# EAGLE design tube_board (EAGLE 8.1.0)

## Sheet 1 of 4
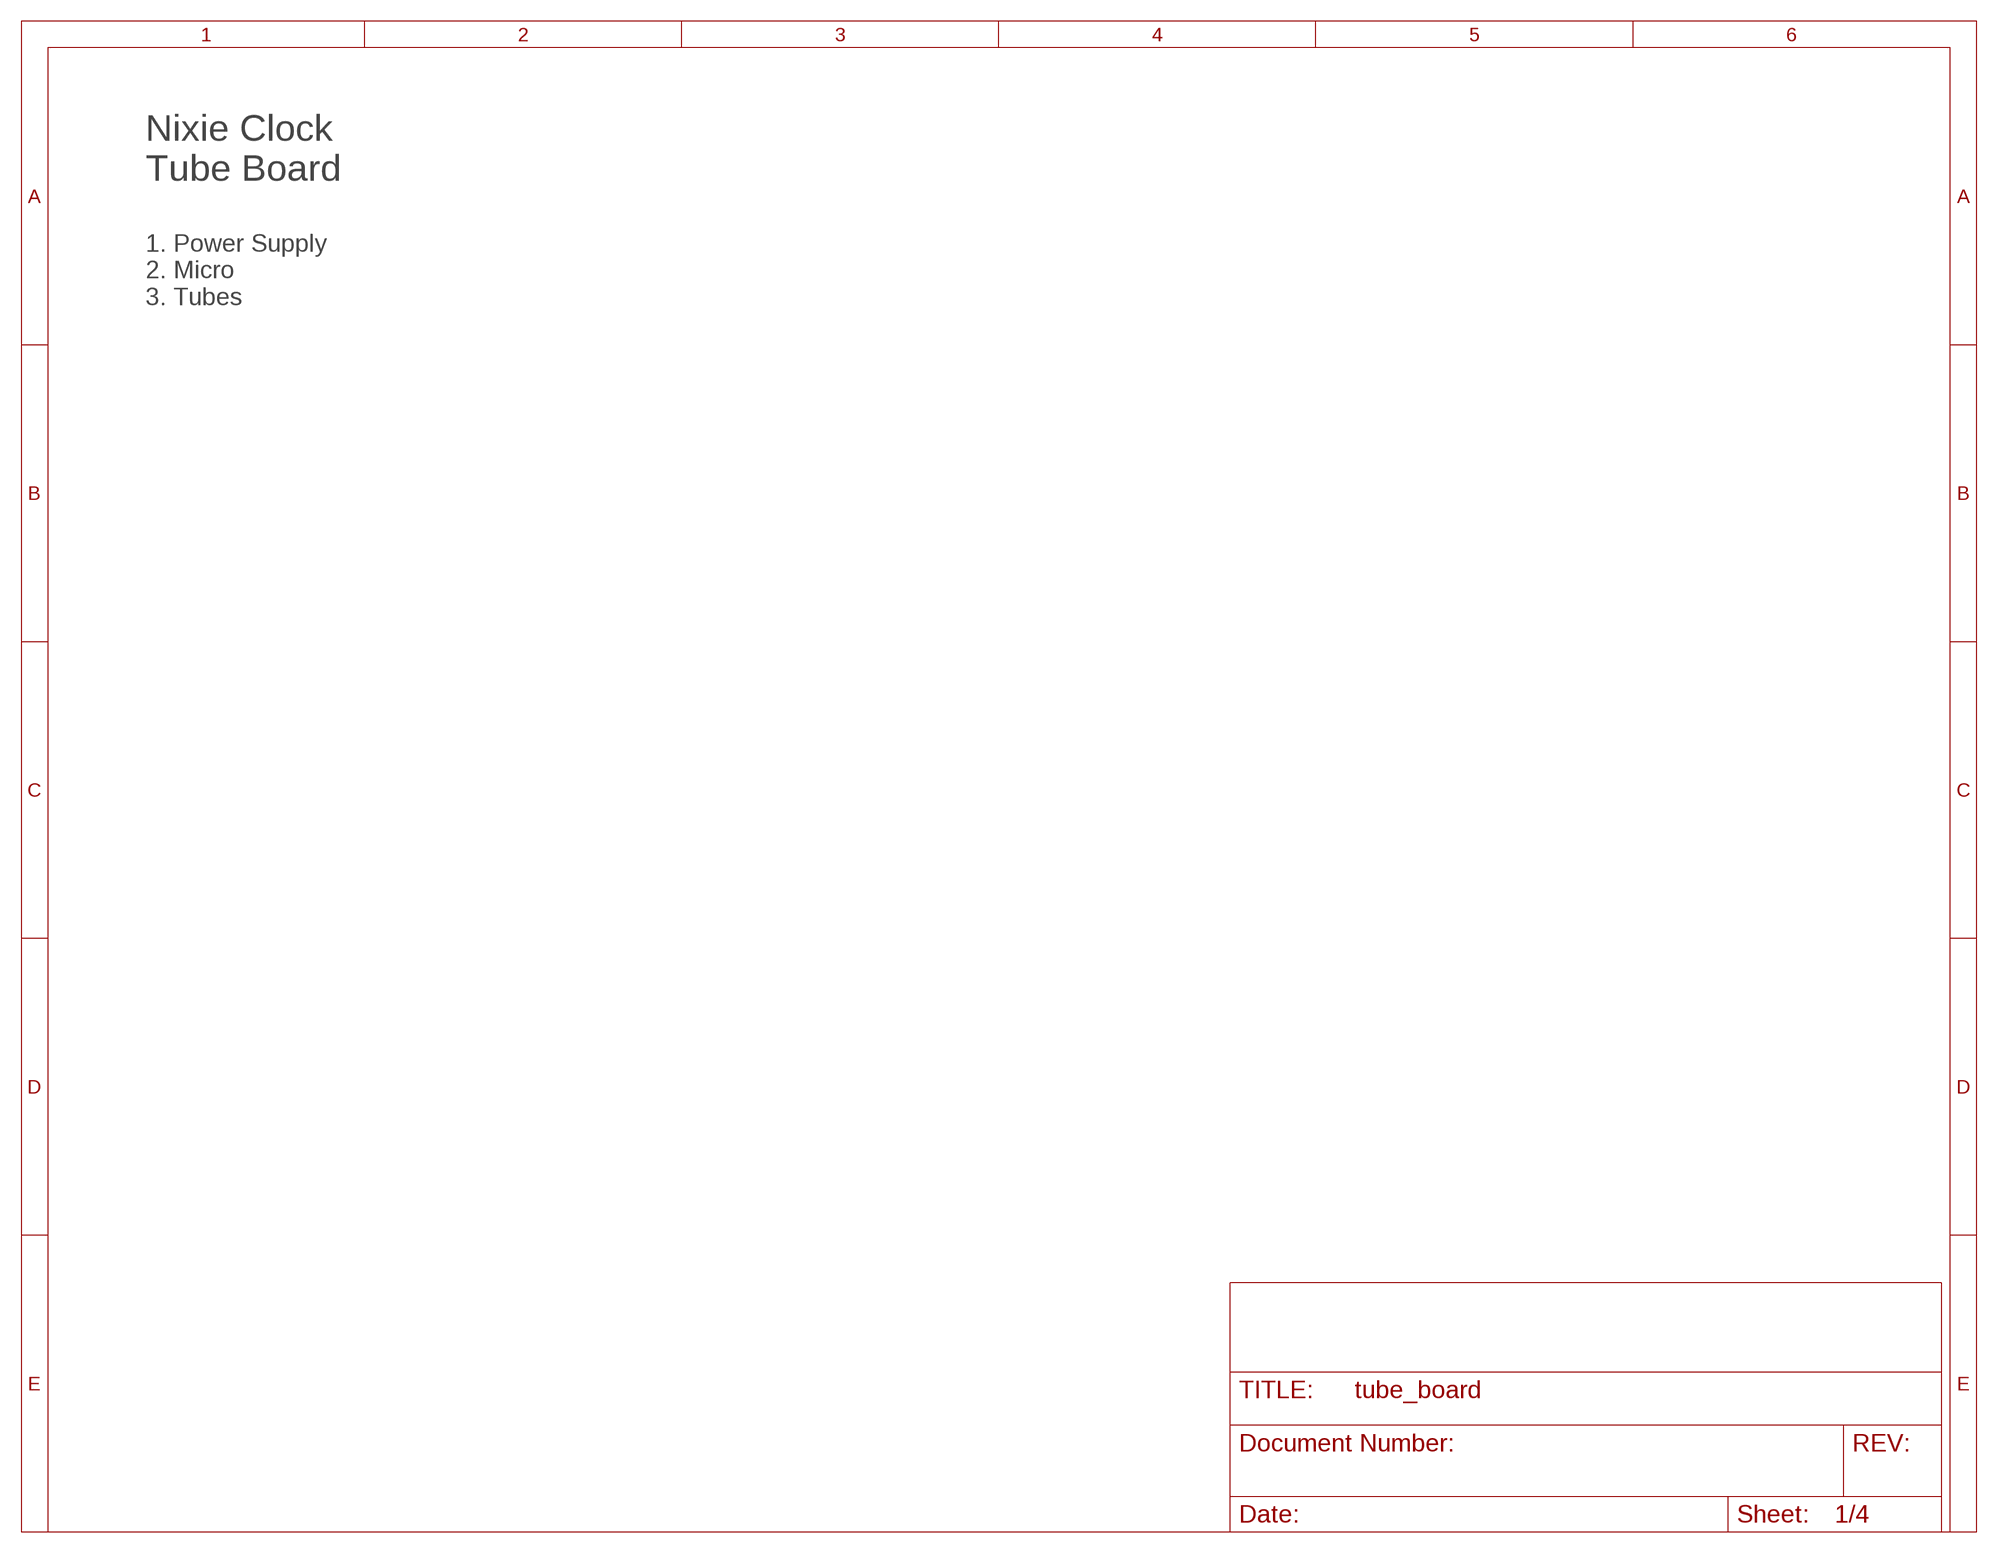
[diagram p0: schematic, sheet 1]

### Notes on the sheet
- Nixie Clock
  Tube Board
- 1. Power Supply
  2. Micro
  3. Tubes

## Sheet 2 of 4
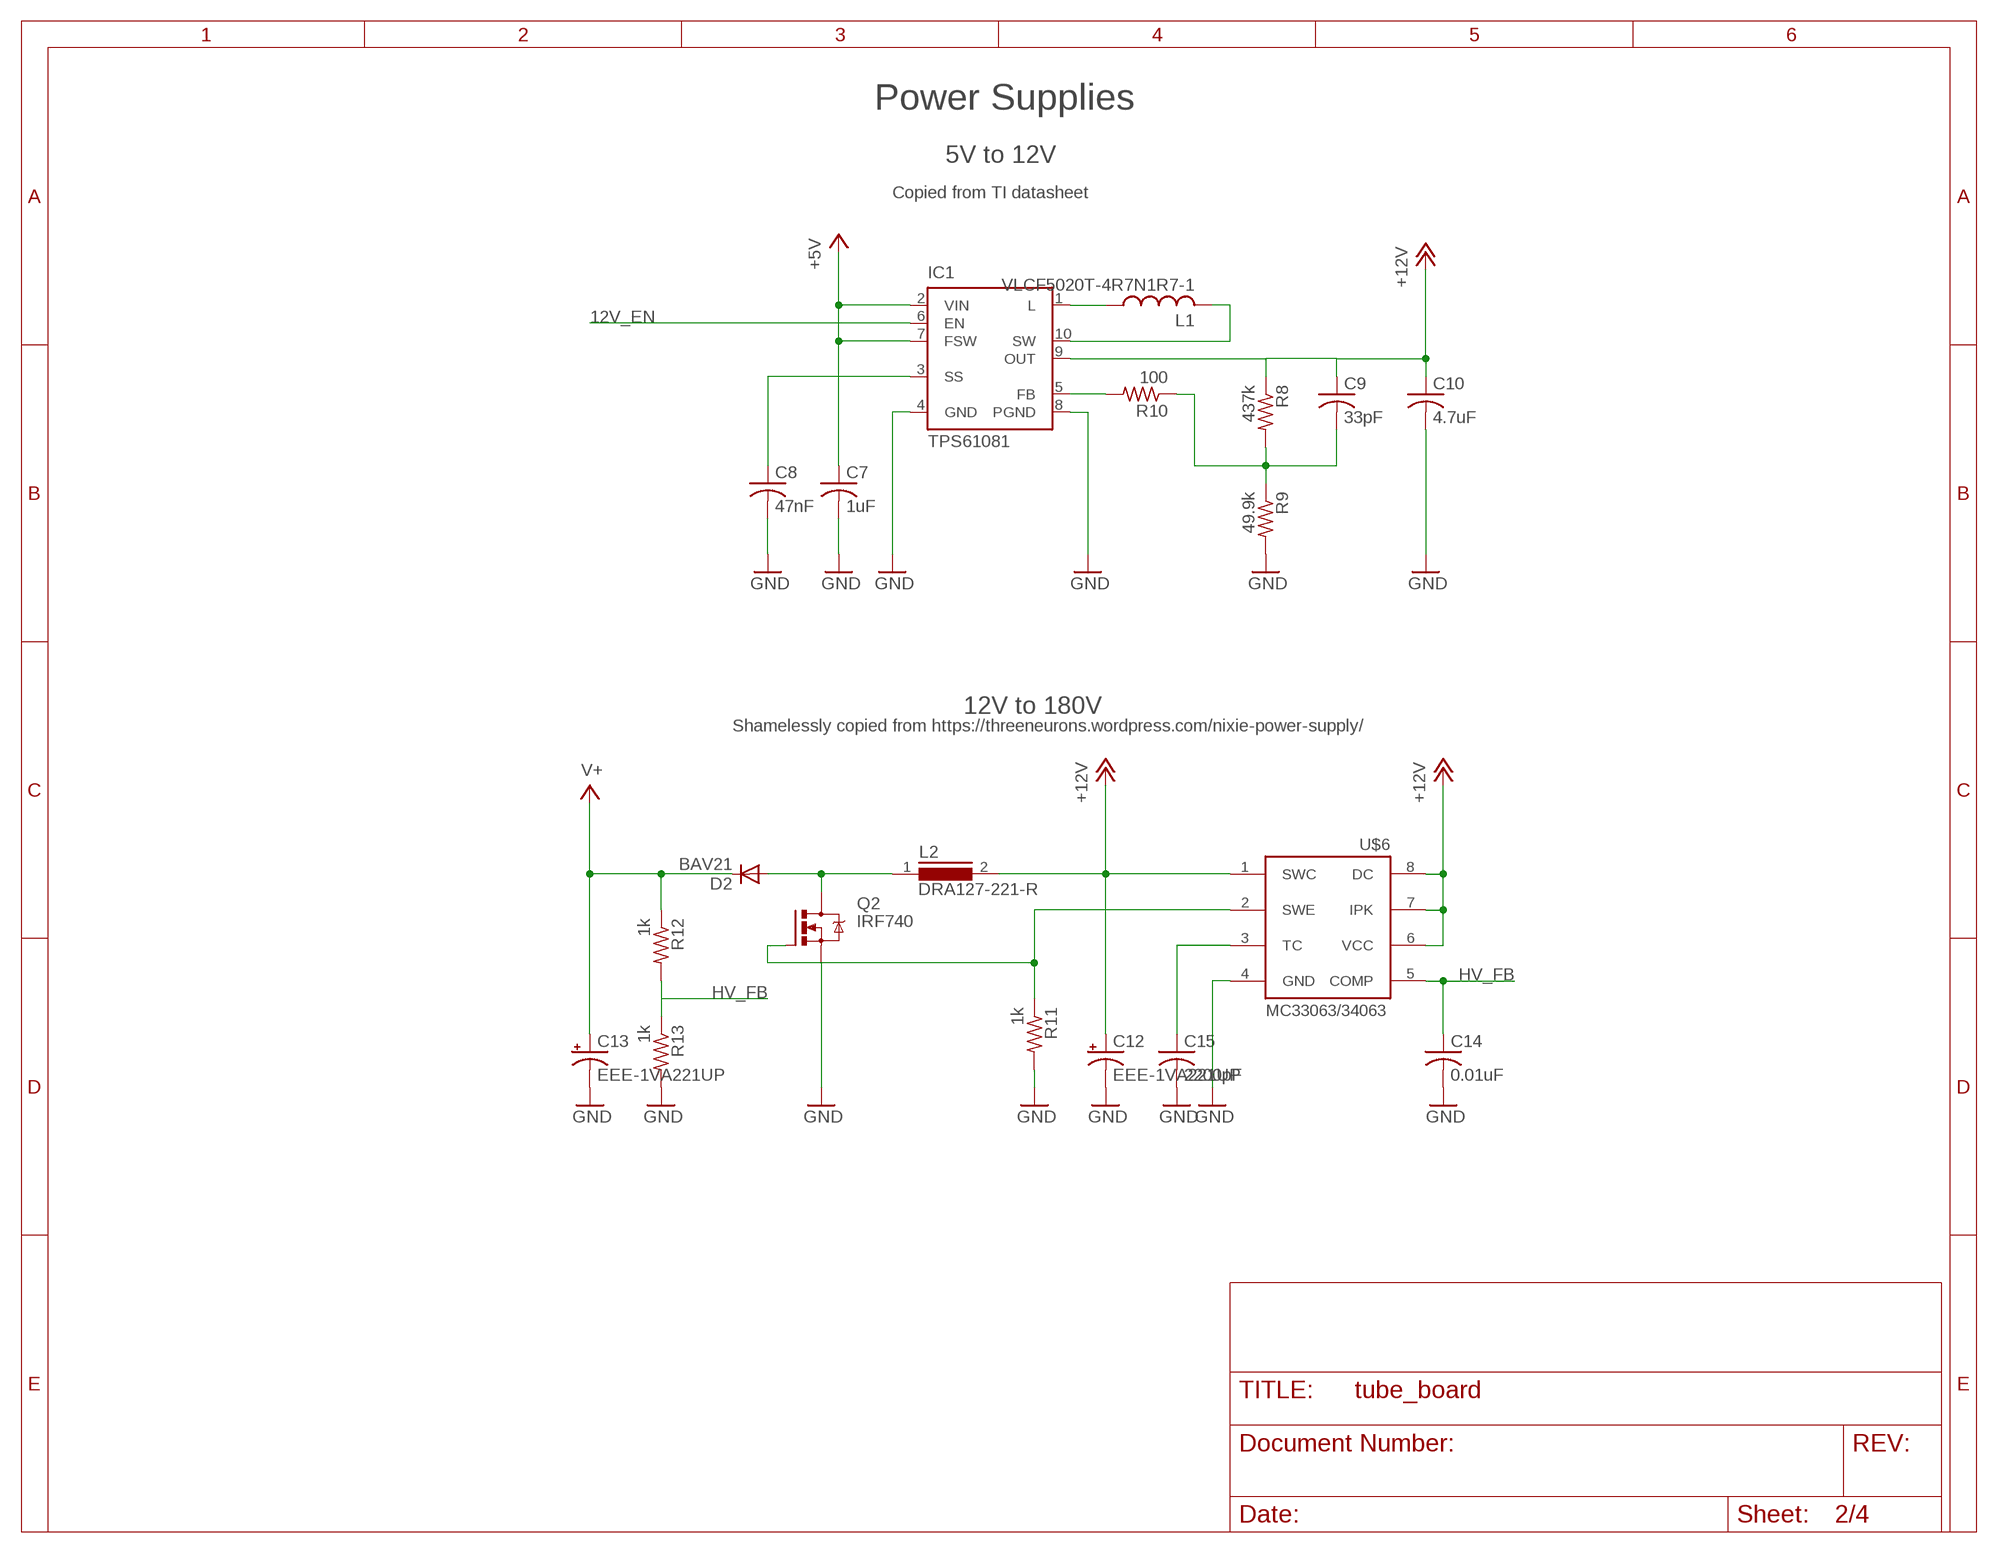
[diagram p1: schematic, sheet 2]

### Parts
C7  1uF  C-USC0603  [C0603]
C8  47nF  C-USC0603  [C0603]
C9  33pF  C-USC0603  [C0603]
C10  4.7uF  C-USC0603  [C0603]
C12  EEE-1VA221UP  CPOL-USG  [PANASONIC_G]
C13  EEE-1VA221UP  CPOL-USG  [PANASONIC_G]
C14  0.01uF  C-USC0603  [C0603]
C15  2200pF  C-USC0603  [C0603]
D2  BAV21  DIODE-SOD323-R  [SOD323-R]
IC1  TPS61081  [S-PDSO-N10]
L1  VLCF5020T-4R7N1R7-1  L-USL5650M  [L5650M]
L2  DRA127-221-R  DR127  [DR127]
Q2  IRF740  [TO220BV]
R8  437k  R-US_R0603  [R0603]
R9  49.9k  R-US_R0603  [R0603]
R10  100  R-US_R0603  [R0603]
R11  1k  R-US_R0603  [R0603]
R12  1k  R-US_R0603  [R0603]
R13  1k  R-US_R0603  [R0603]
U$6  MC34063D  MC33063/MC34063D  [SO08]

### Nets
12V_EN: IC1.6(EN) ; also sheet 3
+5V: C7.1 IC1.2(VIN) IC1.7(FSW) ; also sheet 3,4
+12V: C9.1 C10.1 C12.+ IC1.9(OUT) L2.2 R8.1 U$6.1(SWC) U$6.6(VCC) U$6.7(IPK) U$6.8(DC) ; also sheet 4
GND: C7.2 C8.2 C10.2 C12.- C13.- C14.2 C15.2 IC1.4(GND) IC1.8(PGND) Q2.S R9.2 R11.2 R13.2 U$6.4(GND) ; also sheet 3,4
HV_FB: C14.1 R12.2 R13.1 U$6.5(COMP)
N$8: IC1.1(L) L1.1
N$9: IC1.10(SW) L1.2
N$10: C8.1 IC1.3(SS)
N$12: C9.2 R8.2 R9.1 R10.1
N$13: D2.A L2.1 Q2.D
N$14: C15.1 U$6.3(TC)
N$15: IC1.5(FB) R10.2
N$16: Q2.G R11.1 U$6.2(SWE)
V+: C13.+ D2.C R12.1 ; also sheet 4
Unconnected: IC1.PP(EXP) IC1.PP@1(EXP) IC1.PP@2(EXP)

### Notes on the sheet
- Power Supplies
- 5V to 12V
- Copied from TI datasheet
- 12V to 180V
- Shamelessly copied from https://threeneurons.wordpress.com/nixie-power-supply/

## Sheet 3 of 4
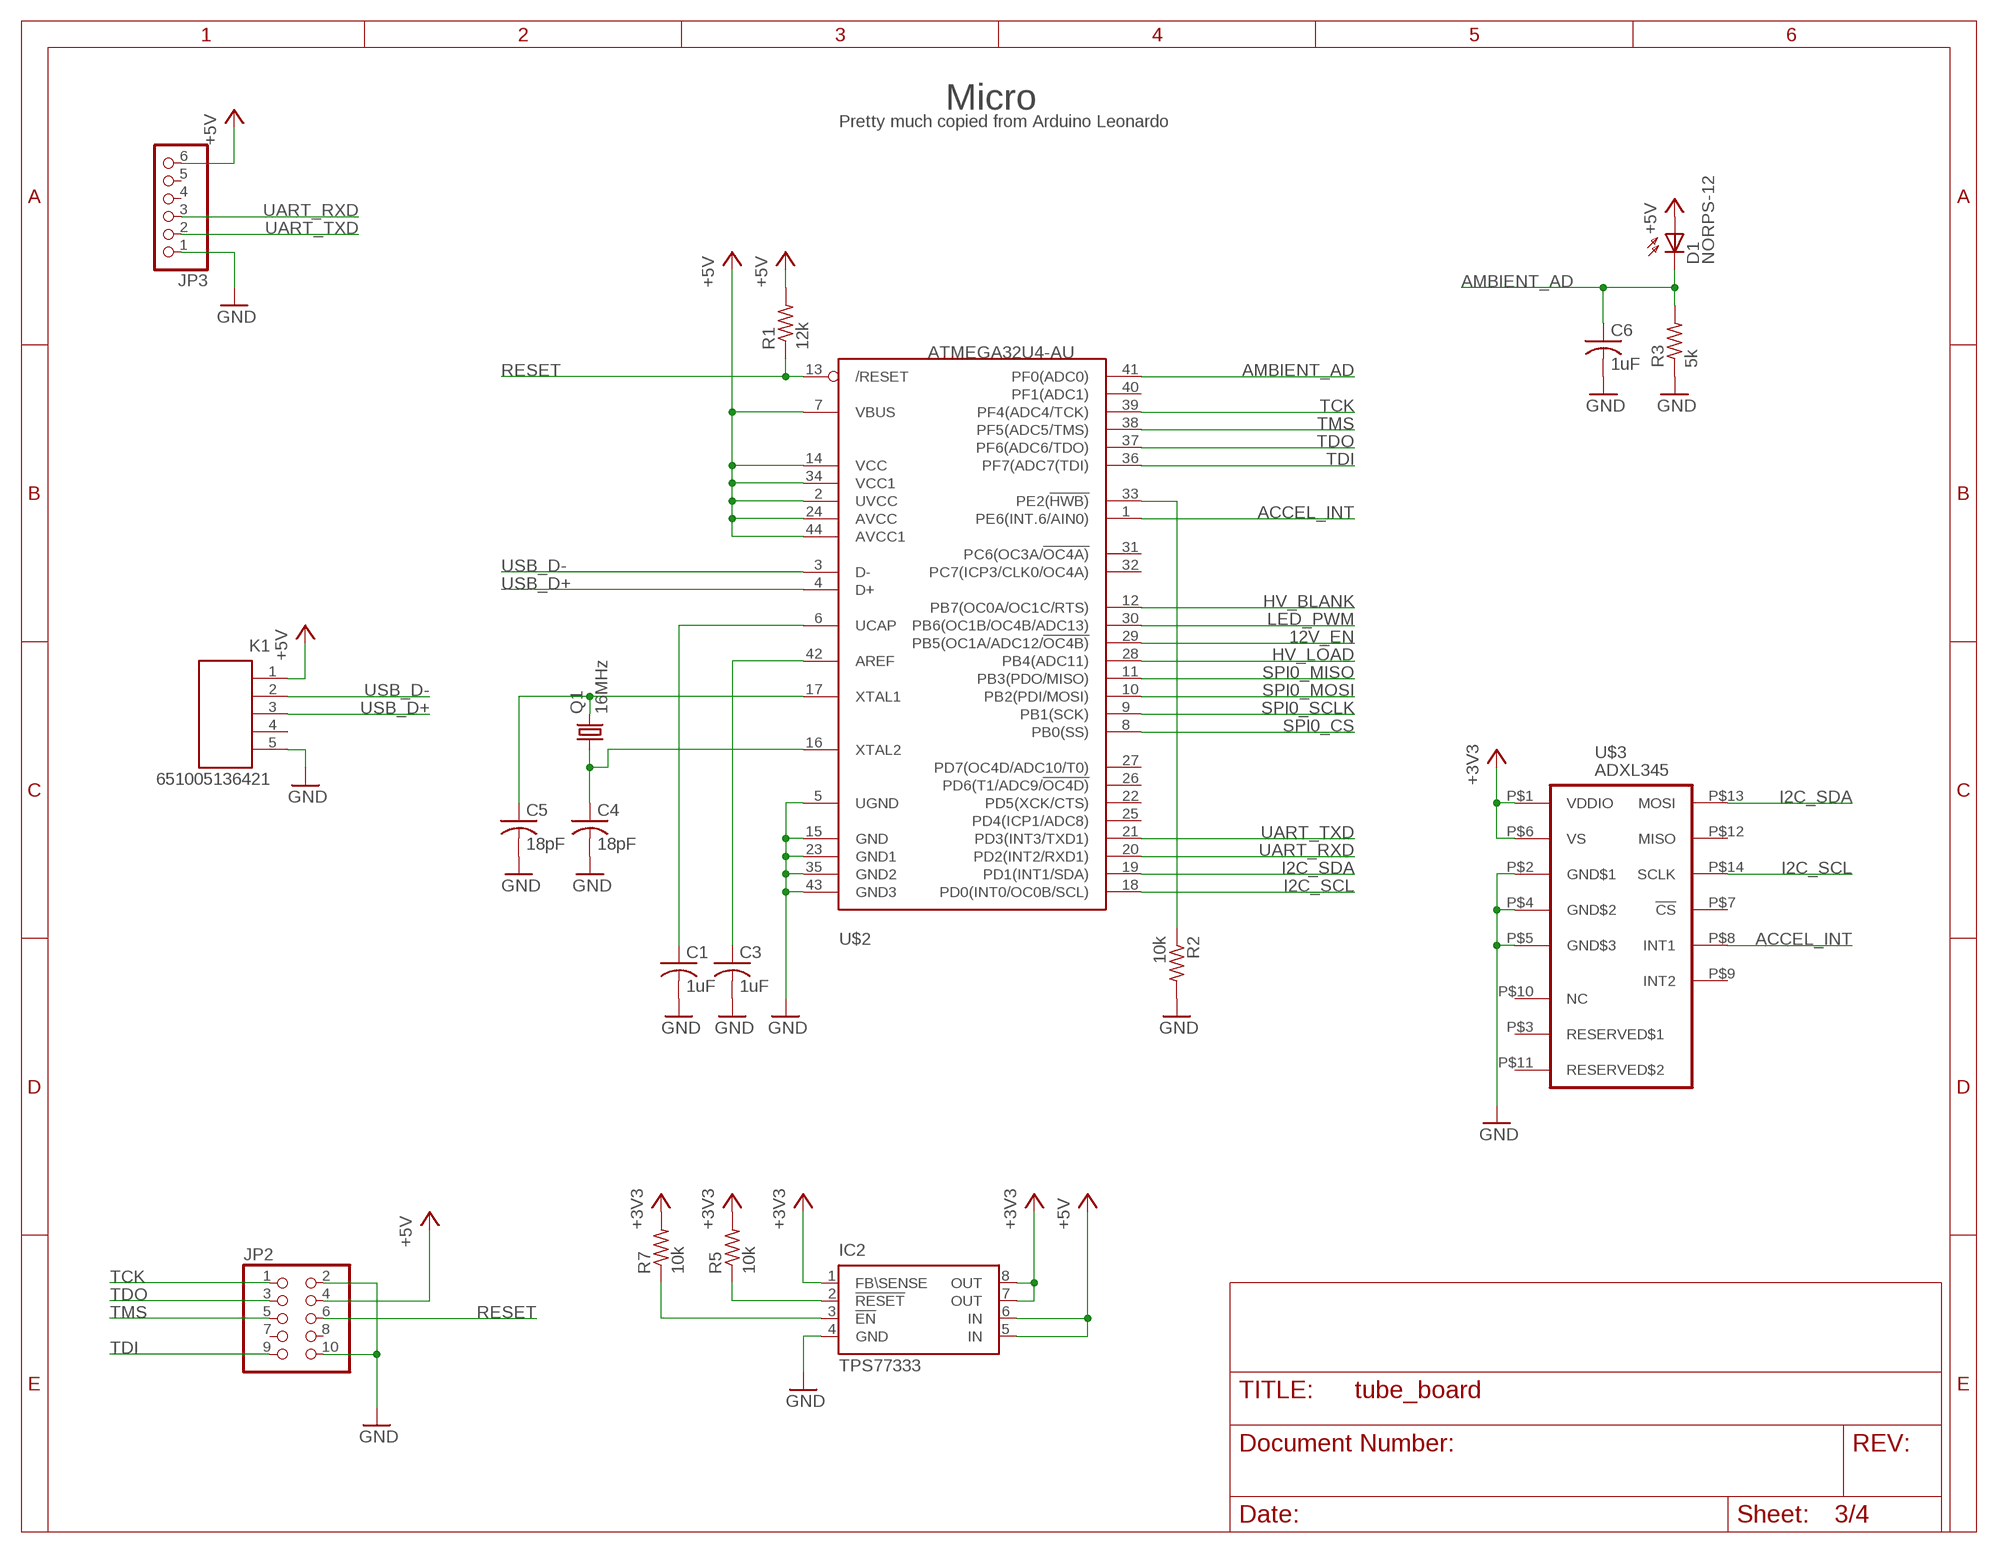
[diagram p2: schematic, sheet 3]

### Parts
C1  1uF  C-USC0603  [C0603]
C3  1uF  C-USC0603  [C0603]
C4  18pF  C-USC0603  [C0603]
C5  18pF  C-USC0603  [C0603]
C6  1uF  C-USC0603  [C0603]
D1  NORPS-12  BPX65  [BPX65]
IC2  TPS77333  [SOP-08]
JP2  PINHD-2X5  [2X05]
JP3  PINHD-1X6  [1X06]
K1  651005136421  [651005136421]
Q1  16MHz  CRYSTALCTS406  [CTS406]
R1  12k  R-US_R0603  [R0603]
R2  10k  R-US_R0603  [R0603]
R3  5k  R-US_R0603  [R0603]
R5  10k  R-US_R0603  [R0603]
R7  10k  R-US_R0603  [R0603]
U$2  ATMEGA32U4-AU  [TQFP44]
U$3  ADXL345  [LGA14]

### Nets
12V_EN: U$2.29(PB5(OC1A/ADC12/!OC4B)) ; also sheet 2
+3V3: IC2.1(FB\SENSE) IC2.7(OUT) IC2.8(OUT) R5.2 R7.2 U$3.P$1(VDDIO) U$3.P$6(VS)
+5V: D1.A IC2.5(IN) IC2.6(IN) JP2.4 JP3.6 K1.1 R1.2 U$2.2(UVCC) U$2.7(VBUS) U$2.14(VCC) U$2.24(AVCC) U$2.34(VCC1) U$2.44(AVCC1) ; also sheet 2,4
ACCEL_INT: U$2.1(PE6(INT.6/AIN0)) U$3.P$8(INT1)
AMBIENT_AD: C6.1 D1.K(C) R3.2 U$2.41(PF0(ADC0))
GND: C1.2 C3.2 C4.2 C5.2 C6.2 IC2.4(GND) JP2.2 JP2.10 JP3.1 K1.5 R2.2 R3.1 U$2.5(UGND) U$2.15(GND) U$2.23(GND1) U$2.35(GND2) U$2.43(GND3) U$3.P$2(GND$1) U$3.P$4(GND$2) U$3.P$5(GND$3) ; also sheet 2,4
HV_BLANK: U$2.12(PB7(OC0A/OC1C/RTS)) ; also sheet 4
HV_LOAD: U$2.28(PB4(ADC11)) ; also sheet 4
I2C_SCL: U$2.18(PD0(INT0/OC0B/SCL)) U$3.P$14(SCLK)
I2C_SDA: U$2.19(PD1(INT1/SDA)) U$3.P$13(MOSI)
LED_PWM: U$2.30(PB6(OC1B/OC4B/ADC13)) ; also sheet 4
N$1: IC2.2(!RESET) R5.1
N$2: C1.1 U$2.6(UCAP)
N$3: C3.1 U$2.42(AREF)
N$4: C5.1 Q1.3 U$2.17(XTAL1)
N$5: C4.1 Q1.1 U$2.16(XTAL2)
N$6: R2.1 U$2.33(PE2(!HWB))
N$7: IC2.3(!EN) R7.1
RESET: JP2.6 R1.1 U$2.13(/RESET)
SPI0_CS: U$2.8(PB0(SS))
SPI0_MISO: U$2.11(PB3(PDO/MISO))
SPI0_MOSI: U$2.10(PB2(PDI/MOSI)) ; also sheet 4
SPI0_SCLK: U$2.9(PB1(SCK)) ; also sheet 4
TCK: JP2.1 U$2.39(PF4(ADC4/TCK))
TDI: JP2.9 U$2.36(PF7(ADC7(TDI))
TDO: JP2.3 U$2.37(PF6(ADC6/TDO))
TMS: JP2.5 U$2.38(PF5(ADC5/TMS))
UART_RXD: JP3.3 U$2.20(PD2(INT2/RXD1))
UART_TXD: JP3.2 U$2.21(PD3(INT3/TXD1))
USB_D+: K1.3 U$2.4(D+)
USB_D-: K1.2 U$2.3(D-)
Unconnected: JP2.7 JP2.8 JP3.4 JP3.5 K1.4 U$2.22(PD5(XCK/CTS)) U$2.25(PD4(ICP1/ADC8)) U$2.26(PD6(T1/ADC9/!OC4D)) U$2.27(PD7(OC4D/ADC10/T0)) U$2.31(PC6(OC3A/!OC4A)) U$2.32(PC7(ICP3/CLK0/OC4A)) U$2.40(PF1(ADC1)) U$3.P$3(RESERVED$1) U$3.P$7(!CS) U$3.P$9(INT2) U$3.P$10(NC) U$3.P$11(RESERVED$2) U$3.P$12(MISO)

### Notes on the sheet
- Micro
- Pretty much copied from Arduino Leonardo

## Sheet 4 of 4
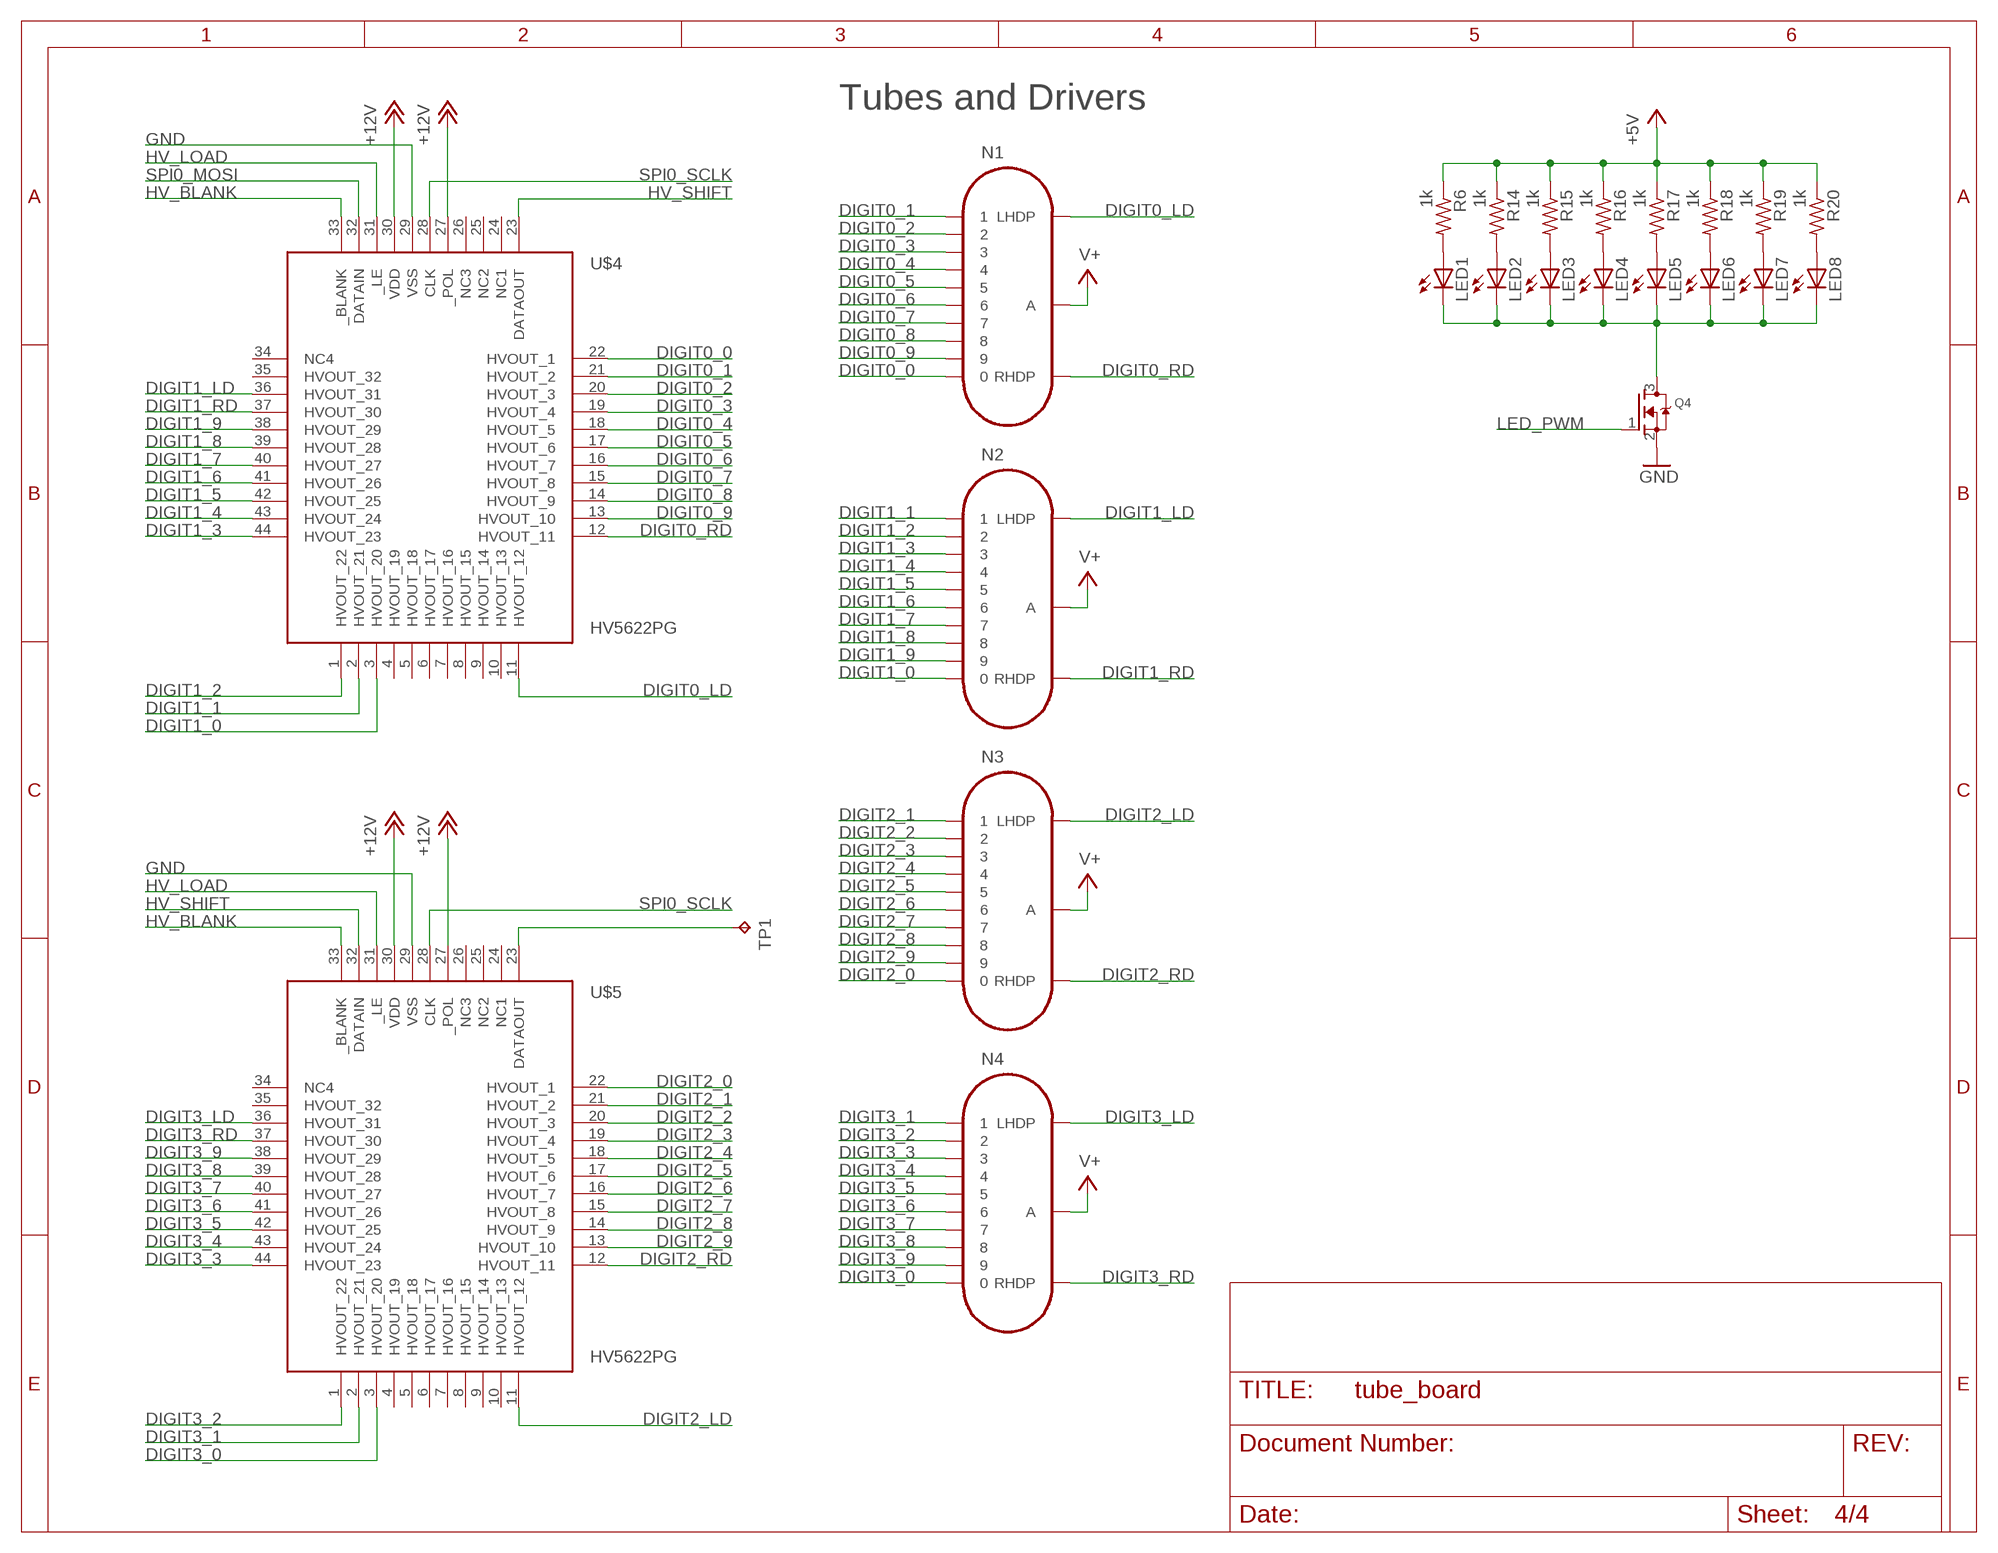
[diagram p3: schematic, sheet 4]

### Parts
LED1  LEDCHIPLED_0603  [CHIPLED_0603]
LED2  LEDCHIPLED_0603  [CHIPLED_0603]
LED3  LEDCHIPLED_0603  [CHIPLED_0603]
LED4  LEDCHIPLED_0603  [CHIPLED_0603]
LED5  LEDCHIPLED_0603  [CHIPLED_0603]
LED6  LEDCHIPLED_0603  [CHIPLED_0603]
LED7  LEDCHIPLED_0603  [CHIPLED_0603]
LED8  LEDCHIPLED_0603  [CHIPLED_0603]
N1  IN-14SMD  [IN-14-SMD]
N2  IN-14SMD  [IN-14-SMD]
N3  IN-14SMD  [IN-14-SMD]
N4  IN-14SMD  [IN-14-SMD]
Q4  MOSFET-NREFLOW  [SOT23]
R6  1k  R-US_R0603  [R0603]
R14  1k  R-US_R0603  [R0603]
R15  1k  R-US_R0603  [R0603]
R16  1k  R-US_R0603  [R0603]
R17  1k  R-US_R0603  [R0603]
R18  1k  R-US_R0603  [R0603]
R19  1k  R-US_R0603  [R0603]
R20  1k  R-US_R0603  [R0603]
TP1  TPTP07R  [TP07R]
U$4  HV5622PG  [PQFP-44]
U$5  HV5622PG  [PQFP-44]

### Nets
+5V: R6.1 R14.1 R15.1 R16.1 R17.1 R18.1 R19.1 R20.1 ; also sheet 2,3
+12V: U$4.30(VDD) U$5.27(_POL) U$5.30(VDD) ; also sheet 2
DIGIT0_0: N1.0 U$4.22(HVOUT_1)
DIGIT0_1: N1.1 U$4.21(HVOUT_2)
DIGIT0_2: N1.2 U$4.20(HVOUT_3)
DIGIT0_3: N1.3 U$4.19(HVOUT_4)
DIGIT0_4: N1.4 U$4.18(HVOUT_5)
DIGIT0_5: N1.5 U$4.17(HVOUT_6)
DIGIT0_6: N1.6 U$4.16(HVOUT_7)
DIGIT0_7: N1.7 U$4.15(HVOUT_8)
DIGIT0_8: N1.8 U$4.14(HVOUT_9)
DIGIT0_9: N1.9 U$4.13(HVOUT_10)
DIGIT0_LD: N1.LHDP U$4.11(HVOUT_12)
DIGIT0_RD: N1.RHDP U$4.12(HVOUT_11)
DIGIT1_0: N2.0 U$4.3(HVOUT_20)
DIGIT1_1: N2.1 U$4.2(HVOUT_21)
DIGIT1_2: N2.2 U$4.1(HVOUT_22)
DIGIT1_3: N2.3 U$4.44(HVOUT_23)
DIGIT1_4: N2.4 U$4.43(HVOUT_24)
DIGIT1_5: N2.5 U$4.42(HVOUT_25)
DIGIT1_6: N2.6 U$4.41(HVOUT_26)
DIGIT1_7: N2.7 U$4.40(HVOUT_27)
DIGIT1_8: N2.8 U$4.39(HVOUT_28)
DIGIT1_9: N2.9 U$4.38(HVOUT_29)
DIGIT1_LD: N2.LHDP U$4.36(HVOUT_31)
DIGIT1_RD: N2.RHDP U$4.37(HVOUT_30)
DIGIT2_0: N3.0 U$5.22(HVOUT_1)
DIGIT2_1: N3.1 U$5.21(HVOUT_2)
DIGIT2_2: N3.2 U$5.20(HVOUT_3)
DIGIT2_3: N3.3 U$5.19(HVOUT_4)
DIGIT2_4: N3.4 U$5.18(HVOUT_5)
DIGIT2_5: N3.5 U$5.17(HVOUT_6)
DIGIT2_6: N3.6 U$5.16(HVOUT_7)
DIGIT2_7: N3.7 U$5.15(HVOUT_8)
DIGIT2_8: N3.8 U$5.14(HVOUT_9)
DIGIT2_9: N3.9 U$5.13(HVOUT_10)
DIGIT2_LD: N3.LHDP U$5.11(HVOUT_12)
DIGIT2_RD: N3.RHDP U$5.12(HVOUT_11)
DIGIT3_0: N4.0 U$5.3(HVOUT_20)
DIGIT3_1: N4.1 U$5.2(HVOUT_21)
DIGIT3_2: N4.2 U$5.1(HVOUT_22)
DIGIT3_3: N4.3 U$5.44(HVOUT_23)
DIGIT3_4: N4.4 U$5.43(HVOUT_24)
DIGIT3_5: N4.5 U$5.42(HVOUT_25)
DIGIT3_6: N4.6 U$5.41(HVOUT_26)
DIGIT3_7: N4.7 U$5.40(HVOUT_27)
DIGIT3_8: N4.8 U$5.39(HVOUT_28)
DIGIT3_9: N4.9 U$5.38(HVOUT_29)
DIGIT3_LD: N4.LHDP U$5.36(HVOUT_31)
DIGIT3_RD: N4.RHDP U$5.37(HVOUT_30)
GND: Q4.2(S) U$4.29(VSS) U$5.29(VSS) ; also sheet 2,3
HV_BLANK: U$4.33(_BLANK) U$5.33(_BLANK) ; also sheet 3
HV_LOAD: U$4.31(_LE) U$5.31(_LE) ; also sheet 3
HV_SHIFT: U$4.23(DATAOUT) U$5.32(DATAIN)
LED_PWM: Q4.1(G) ; also sheet 3
N$17: LED1.A R6.2
N$18: LED2.A R14.2
N$19: LED3.A R15.2
N$20: LED4.A R16.2
N$21: LED5.A R17.2
N$22: LED6.A R18.2
N$23: LED7.A R19.2
N$24: LED8.A R20.2
N$25: LED1.C LED2.C LED3.C LED4.C LED5.C LED6.C LED7.C LED8.C Q4.3(D)
N$31: U$4.27(_POL)
N$40: TP1.TP U$5.23(DATAOUT)
SPI0_MOSI: U$4.32(DATAIN) ; also sheet 3
SPI0_SCLK: U$4.28(CLK) U$5.28(CLK) ; also sheet 3
V+: N1.A N2.A N3.A N4.A ; also sheet 2
Unconnected: U$4.4(HVOUT_19) U$4.5(HVOUT_18) U$4.6(HVOUT_17) U$4.7(HVOUT_16) U$4.8(HVOUT_15) U$4.9(HVOUT_14) U$4.10(HVOUT_13) U$4.24(NC1) U$4.25(NC2) U$4.26(NC3) U$4.34(NC4) U$4.35(HVOUT_32) U$5.4(HVOUT_19) U$5.5(HVOUT_18) U$5.6(HVOUT_17) U$5.7(HVOUT_16) U$5.8(HVOUT_15) U$5.9(HVOUT_14) U$5.10(HVOUT_13) U$5.24(NC1) U$5.25(NC2) U$5.26(NC3) U$5.34(NC4) U$5.35(HVOUT_32)

### Notes on the sheet
- Tubes and Drivers

## Library data of the parts
C1 C3-C10 C14 C15 = resistor:C-US: CAPACITOR, American symbol
C12 C13 = rcl:CPOL-US: POLARIZED CAPACITOR, American symbol
D1 = opto-trans-siemens:BPX65: PHOTO DIODE; MPN: BPX65.; OC_FARNELL: 327451; OC_NEWARK: 06WX2764
D2 = diode:DIODE-: DIODE
IC1 = texas:TPS6108*: HIGH VOLTAGE DC/DC BOOST CONVERTER WITH 0.5-A/1.3-A INTEGRATED SWITCH Source: www.ti.com .. tps61081[1].pdf; MPN: TPS61081DRCT; OC_FARNELL: 1412518; OC_NEWARK: 30M1833
IC2 = texas:TPS773*: 250-mA LDO REGULATORS WITH RESET OUTPUT WITH 8-PIN MSOP PACKAGING Source: http://focus.ti.com/lit/ds/symlink/tps77333.pdf; MF: TEXAS INSTRUMENTS; MPN: TPS77333DGK; OC_FARNELL: 1510195; OC_NEWARK: 02M1919
JP2 = pinhead:PINHD-2X5: PIN HEADER
JP3 = pinhead:PINHD-1X6: PIN HEADER
K1 = Wuerth_Elektronik_eiCan_Communication_Connectors_v2.2:651005136421: WR-COM Vertical 5 Contacts Mini USB Type B, 5 pins
L1 = rcl:L-US: INDUCTOR, American symbol
L2 = inductors:DR127: High Power Density, High Efficiency, Shielded Inductors Source: coiltronics_dr_series.pdf
LED1-LED8 = led:LED: LED OSRAM: - CHIPLED LG R971, LG N971, LY N971, LG Q971, LY Q971, LO R971, LY R971 LH N974, LH R974 LS Q976, LO Q976, LY Q976 LO Q996 - Hyper CHIPLED LW Q18S LB Q993, LB Q99A, LB R99A - SideLED LS A670, LO A670, LY A670, LG A670, LP A670 LB A673, LV A673, LT A673, LW A673 LH A674 LY A675 LS A676, LA A676, LO A676, LY A676, LW A676 LS A679, LY A679, LG A679 - Hyper Micro SIDELED® LS Y876, LA Y876, LO Y876, LY Y876 LT Y87S - SmartLED LW L88C, LW L88S LB L89C, LB L89S, LG L890 LS L89K, LO L89K, LY L89K LS L896, LA L896, LO L896, LY L896 - TOPLED LS T670, LO T670, LY T670, LG T670, LP T670 LSG T670, LSP T670, LSY T670, LOP T670, LYG T670 LG T671, LOG T671, LSG T671 LB T673, LV T673, LT T673, LW T673 LH T674 LS T676, LA T676, LO T676, LY T676, LB T676, LH T676, LSB T676, LW T676 LB T67C, LV T67C, LT T67C, LS T67K, LO T67K, LY T67K, LW E67C LS E67B, LA E67B, LO E67B, LY E67B, LB E67C, LV E67C, LT E67C LW T67C LS T679, LY T679, LG T679 LS T770, LO T770, LY T770, LG T770, LP T770 LB T773, LV T773, LT T773, LW T773 LH T774 LS E675, LA E675, LY E675, LS T675 LS T776, LA T776, LO T776, LY T776, LB T776 LHGB T686 LT T68C, LB T68C - Hyper Mini TOPLED® LB M676 - Mini TOPLED Santana® LG M470 LS M47K, LO M47K, LY M47K Source: http://www.osram.convergy.de LUXEON: - LUMILED® LXK2-PW12-R00, LXK2-PW12-S00, LXK2-PW14-U00, LXK2-PW14-V00 LXK2-PM12-R00, LXK2-PM12-S00, LXK2-PM14-U00 LXK2-PE12-Q00, LXK2-PE12-R00, LXK2-PE12-S00, LXK2-PE14-T00, LXK2-PE14-U00 LXK2-PB12-K00, LXK2-PB12-L00, LXK2-PB12-M00, LXK2-PB14-N00, LXK2-PB14-P00, LXK2-PB14-Q00 LXK2-PR12-L00, LXK2-PR12-M00, LXK2-PR14-Q00, LXK2-PR14-R00 LXK2-PD12-Q00, LXK2-PD12-R00, LXK2-PD12-S00 LXK2-PH12-R00, LXK2-PH12-S00 LXK2-PL12-P00, LXK2-PL12-Q00, LXK2-PL12-R00 Source: www.luxeon.com KINGBRIGHT: KA-3528ASYC Source: www.kingbright.com
N1-N4 = russian-nixies:IN-14: IN-14: medium numeric frontview nixie tube
Q1 = adafruit:CRYSTAL: CRYSTAL; OC_FARNELL: unknown; OC_NEWARK: unknown
Q2 = transistor-power:IRF740: N-CHANNEL MOS FET
Q4 = adafruit:MOSFET-N: N-Channel Mosfet 2N7002E - 60V 260mA SOT23 [Digikey: 2N7002ET1GOSTR-ND] - REEL BSH103 - 30V 850mA SOT23 [Digikey: 568-5013-1-ND]
R1-R3 R5 R7 = resistor:R-US_: RESISTOR, American symbol
R6 R8-R20 = rcl:R-US_: RESISTOR, American symbol
TP1 = testpad:TP: Test pad
U$2 = adafruit:ATMEGA32U4: http://www.ladyada.net/library/eagle
U$3 = adxl345:ADXL345: 3-Axis, ±2 g/±4 g/±8 g/±16 g Digital Accelerometer
U$4 U$5 = nixie:HV5622: Supertex Inc. HV5622 32-Channel Serial to Parallel Converter With Open Drain Outputs
U$6 = adafruit:MC33063/MC34063: MC33063 and MC34063 Basic DC/DC converter with internal power-NPN transistor, 100KHz, 1.5A peak switch current. 3-40 input/output.

## Board
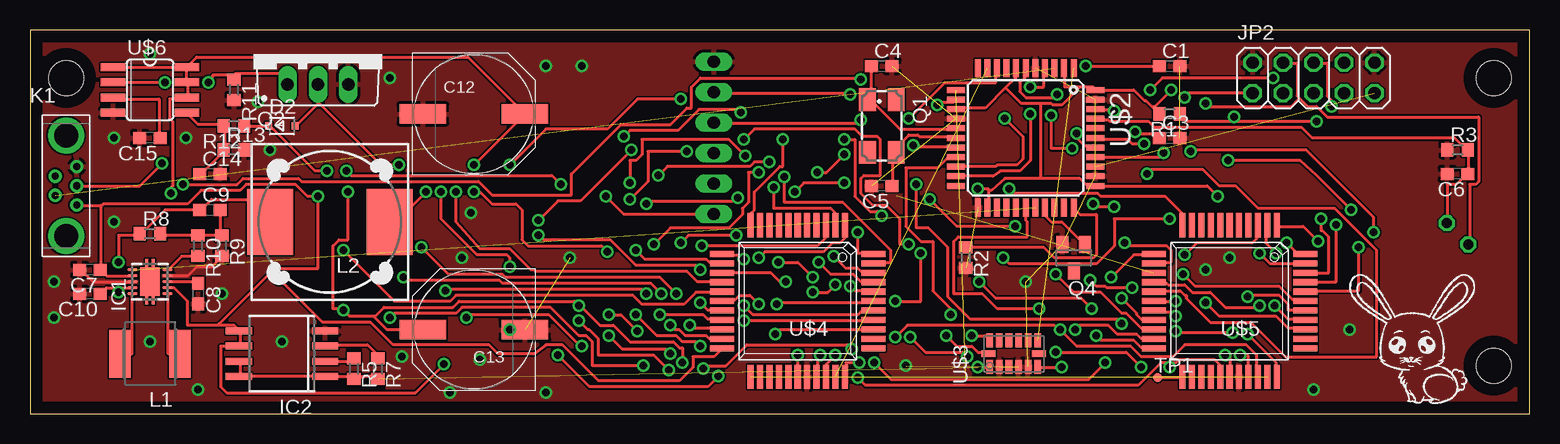
[diagram p4: board, top side]
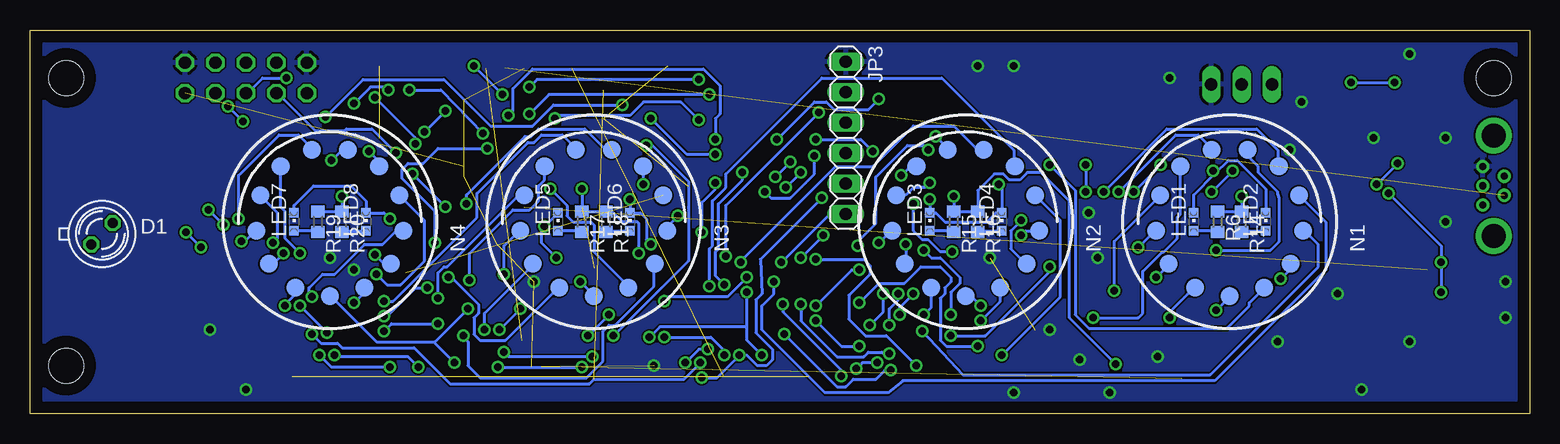
[diagram p5: board, bottom side, seen from below]

Size 125 x 32 mm. Coordinates in mm from the lower left corner, seen from the top.
Outline: 0,0 125,0 125,32 0,32 0,0
Copper layers (1*16): Top 0.035mm / dielectric 1.5mm / Bottom 0.035mm
Design rules "default *": minimum track width 10mil, minimum drill 13mil, track to track 6mil, track to pad 6mil, pad to pad 6mil, via to via 6mil, smd to smd 6mil, copper to edge 40mil, drill to drill 8mil, minimum pad ring 10mil, minimum via ring 8mil, stop-mask expansion 4mil, vias tented up to drill 0mil, thermal gap 10mil
Holes 2.9 mm at 3,28 122,4 122,28

### Footprints (pad centres in the part's own frame; a part is rotated, then mirrored left to right if it is on the bottom)
C0603 = smd 1.1 x 1: 1 -0.85,0; 2 0.85,0
PANASONIC_G = smd 3.9 x 1.6: + 4.25,0; - -4.25,0
BPX65 = drill 0.813 octagon: A -0.889,-0.889; K 0.889,0.889
SOD323-R = smd 0.6 x 0.6: A 1.1,0; C -1.1,0
S-PDSO-N10 = smd 0.28 x 0.85: 1 -1,-1.475; 2 -0.5,-1.475; 3 0,-1.475; 4 0.5,-1.475; 5 1,-1.475; 6 1,1.475; 7 0.5,1.475; 8 0,1.475; 9 -0.5,1.475; 10 -1,1.475 | smd 2.4 x 1.65: PP 0,0 | smd 3.8 x 0.28: PP@1 0,0.275; PP@2 0,-0.275
SOP-08 = smd 0.6 x 2.2: 1 -1.905,-3.6; 2 -0.635,-3.6; 3 0.635,-3.6; 4 1.905,-3.6; 5 1.905,3.575; 6 0.635,3.575; 7 -0.635,3.575; 8 -1.905,3.575
2X05 = drill 1.016 octagon: 1 -5.08,-1.27; 2 -5.08,1.27; 3 -2.54,-1.27; 4 -2.54,1.27; 5 0,-1.27; 6 0,1.27; 7 2.54,-1.27; 8 2.54,1.27; 9 5.08,-1.27; 10 5.08,1.27
1X06 = drill 1.016 long: 1 -6.35,0; 2 -3.81,0; 3 -1.27,0; 4 1.27,0; 5 3.81,0; 6 6.35,0
651005136421 = drill 0.6: 1 0.9,-1.6; 2 -0.9,-0.8; 3 0.9,0; 4 -0.9,0.8; 5 0.9,1.6 | drill 2: Z1 0,4.2; Z2 0,-4.2
L5650M = smd 1.8 x 4: 1 -2.5,0; 2 2.5,0
DR127 = smd 3.85 x 5.5: 1 -4.975,0; 2 4.975,0
CHIPLED_0603 = smd 0.8 x 0.8: A 0,-0.75; C 0,0.75
IN-14-SMD = smd 1.5 x 1.5: 0 5.094,-3.516; 1 -5.094,-3.516; 2 -6.145,-0.746; 3 -5.788,2.195; 4 -4.105,4.633; 5 -1.481,6.01; 6 1.481,6.01; 7 4.105,4.633; 8 5.788,2.195; 9 6.145,-0.746; A 0,-6.189; LHDP 2.876,-5.481; RHDP -2.876,-5.481
CTS406 = smd 1.9 x 1.4: 1 -2.2,-1.2; 2 2.2,-1.2; 3 2.2,1.2; 4 -2.2,1.2
TO220BV = drill 1.016 long: D 0,-2.54; G -2.54,-2.54; S 2.54,-2.54
SOT23 = smd 1 x 1.4: 1 -0.95,-1.1; 2 0.95,-1.1; 3 0,1.1
R0603 = smd 1 x 1.1: 1 -0.85,0; 2 0.85,0
TP07R = smd 0.7 x 0.7: TP 0,0
TQFP44 = smd 1.5 x 0.5: 1 -5.8,4; 2 -5.8,3.2; 3 -5.8,2.4; 4 -5.8,1.6; 5 -5.8,0.8; 6 -5.8,0; 7 -5.8,-0.8; 8 -5.8,-1.6; 9 -5.8,-2.4; 10 -5.8,-3.2; 11 -5.8,-4; 23 5.8,-4; 24 5.8,-3.2; 25 5.8,-2.4; 26 5.8,-1.6; 27 5.8,-0.8; 28 5.8,0; 29 5.8,0.8; 30 5.8,1.6; 31 5.8,2.4; 32 5.8,3.2; 33 5.8,4 | smd 0.5 x 1.5: 12 -4,-5.8; 13 -3.2,-5.8; 14 -2.4,-5.8; 15 -1.6,-5.8; 16 -0.8,-5.8; 17 0,-5.8; 18 0.8,-5.8; 19 1.6,-5.8; 20 2.4,-5.8; 21 3.2,-5.8; 22 4,-5.8; 34 4,5.8; 35 3.2,5.8; 36 2.4,5.8; 37 1.6,5.8; 38 0.8,5.8; 39 0,5.8; 40 -0.8,5.8; 41 -1.6,5.8; 42 -2.4,5.8; 43 -3.2,5.8; 44 -4,5.8
LGA14 = smd 1.15 x 0.55: P$1 -1.1,2; P$2 -1.1,1.2; P$3 -1.1,0.4; P$4 -1.1,-0.4; P$5 -1.1,-1.2; P$6 -1.1,-2; P$8 1.1,-2; P$9 1.1,-1.2; P$10 1.1,-0.4; P$11 1.1,0.4; P$12 1.1,1.2; P$13 1.1,2 | smd 0.55 x 1.15: P$7 0,-2.1; P$14 0,2.1
PQFP-44 = smd 0.508 x 2.007: 1 -3.937,-6.706; 2 -3.15,-6.706; 3 -2.362,-6.706; 4 -1.575,-6.706; 5 -0.787,-6.706; 6 0,-6.706; 7 0.787,-6.706; 8 1.575,-6.706; 9 2.362,-6.706; 10 3.15,-6.706; 11 3.937,-6.706; 23 3.937,5.944; 24 3.15,5.944; 25 2.362,5.944; 26 1.575,5.944; 27 0.787,5.944; 28 0,5.944; 29 -0.787,5.944; 30 -1.575,5.944; 31 -2.362,5.944; 32 -3.15,5.944; 33 -3.937,5.944 | smd 2.007 x 0.508: 12 6.325,-4.318; 13 6.325,-3.531; 14 6.325,-2.743; 15 6.325,-1.956; 16 6.325,-1.168; 17 6.325,-0.381; 18 6.325,0.406; 19 6.325,1.194; 20 6.325,1.981; 21 6.325,2.769; 22 6.325,3.556; 34 -6.325,3.556; 35 -6.325,2.769; 36 -6.325,1.981; 37 -6.325,1.194; 38 -6.325,0.406; 39 -6.325,-0.381; 40 -6.325,-1.168; 41 -6.325,-1.956; 42 -6.325,-2.743; 43 -6.325,-3.531; 44 -6.325,-4.318
SO08 = smd 0.66 x 2.032: 1 -1.905,-3.073; 2 -0.635,-3.073; 3 0.635,-3.073; 4 1.905,-3.073; 5 1.905,3.073; 6 0.635,3.073; 7 -0.635,3.073; 8 -1.905,3.073

### Placement (x,y rotation side)
C1  95,29 0 top
C3  95,23 0 top
C4  71,29 0 top
C5  71,19 180 top
C6  119,20 180 top
C7  5,12 180 top
C8  14,10 270 top
C9  15,17 0 top
C10  5,10 180 top
C12  37,25 0 top
C13  37,7 180 top
C14  15,20 0 top
C15  10,23 180 top
D1  119,15 0 bottom
D2  21,24 0 top
IC1  10,11 90 top
IC2  21,5 90 top
JP2  107,28 0 top
JP3  57,23 270 bottom
K1  3,19 0 top
L1  10,5 180 top
L2  25,16 180 top
LED1  28,16 0 bottom
LED2  22,16 0 bottom
LED3  50,16 0 bottom
LED4  44,16 0 bottom
LED5  81,16 0 bottom
LED6  75,16 0 bottom
LED7  103,16 0 bottom
LED8  97,16 0 bottom
N1  25,16 0 bottom
N2  47,16 0 bottom
N3  78,16 0 bottom
N4  100,16 0 bottom
Q1  71,24 270 top
Q2  24,30 0 top
Q4  87,13 180 top
R1  95,25 180 top
R2  78,13 270 top
R3  119,22 0 top
R5  27,3.75 270 top
R6  26,16 270 bottom
R7  29,3.75 270 top
R8  10,15 0 top
R9  16,14 270 top
R10  14,14 270 top
R11  17,27 270 top
R12  17,24 180 top
R13  17,22 0 top
R14  24,16 270 bottom
R15  48,16 270 bottom
R16  46,16 270 bottom
R17  79,16 270 bottom
R18  77,16 270 bottom
R19  101,16 270 bottom
R20  99,16 270 bottom
TP1  94,3 0 top
U$2  83,23 270 top
U$3  82,5 90 top
U$4  64,9 180 top
U$5  100,9 180 top
U$6  10,27 270 top

### Tracks (layer width: path | path; a pad name or v marks a point on that pad's centre or on a via)
12V_EN  (1 unrouted)
+3V3  (via drill 0.61)  (1 unrouted)
  Top 0.254: IC2.7 17.5,4.25 17.5,3.12 IC2.8 17.62,3.12 24.5,3.12 IC2.1 24.62,3.12 27.88,3.12 R5.2 28,3.12 28.75,3.12 R7.2 | v79,3.88 80,3.88 U$3.P$1 | v86,3.88 84,3.88 U$3.P$6
  Bottom 0.254: v86,3.88 v79,3.88
+5V  (via drill 0.61)
  Top 0.254: 105.81,26.31 105.62,26.5 105.62,29.25 104.5,29.25 JP2.4 | 105.81,26.31 106.5,25.62 107.25,25.62 108.12,24.75 120.75,24.75 120.75,19.38 120.5,19.12 120,19.12 120,14.12 D1.A | 81.31,27.19 82.12,28 82.12,28.75 U$2.7 | 81.31,27.19 79.62,25.5 77.25,25.5 U$2.14 | 93.56,25.56 93,26.12 92.88,26.12 92,27 U$2.44 88.75,27.12 88.62,27.25 87.38,27.25 | 93.56,25.56 94.12,25 R1.2 | 87.38,27.25 86.25,27.25 86.25,28.75 U$2.2 | 81.31,27.19 82.62,25.88 84.25,25.88 | 84.25,25.88 85.12,25.88 85.25,25.75 86,25.75 87.38,27.12 87.38,27.25 | 79.88,18.62 79.88,18.75 v79,18.75 | 79.88,18.62 79.88,17.25 U$2.24 | 84.25,19.62 87.5,19.62 88.12,19 U$2.34 98.12,19 v99,18.12 | 84.25,19.62 81.25,19.62 80.12,18.62 79.88,18.62 | 84.25,19.62 84.25,25.88 | 105.81,26.31 105.12,25.62 98.25,25.62 v98,25.88 | v95.12,27 93.75,25.62 93.62,25.62 93.56,25.56 | v48,18.12 49.5,16.62 57,16.62 JP3.6 | IC1.7 6.38,11.5 5.88,12 C7.1 5.88,12.12 5.88,17.38 | 5.88,17.38 4,17.38 K1.1 | IC1.2 12,10.5 13.12,9.38 13.12,7.38 15.75,7.38 | 15.75,7.38 17,7.38 17.38,7 IC2.5 17.5,6.88 17.5,5.75 IC2.6 17.38,5.62 15.88,5.62 15.88,2.25 16.38,1.75 32.12,1.75 v34.5,4.12 | 15.75,7.38 15.75,7.5 20.38,12.12 24,12.12 v24,18.12 23.12,18.12 22.12,19.12 18,19.12 17.5,18.62 14.25,18.62 13.12,17.5 6.12,17.5 6,17.38 5.88,17.38 | v74.25,13.38 74.25,9.38 v72.12,9.38 | v65.25,11.38 64,12.62 v62.38,12.62
  Bottom 0.254: R19.1 101,16.88 99,16.88 R20.1 v99,18.12 | v79,18.75 R17.1 79,16.88 77,16.88 R18.1 76.88,16.88 76.5,16.88 75.62,16 74.38,16 74.25,15.88 v74.25,13.38 | v98,25.88 96.62,27.25 95.38,27.25 v95.12,27 | v48,18.12 R15.1 48,16.88 46,16.88 R16.1 46,18.62 44.62,20 43.88,20 43.38,19.5 42.5,19.5 41.88,20.12 40.75,20.12 38.38,17.75 38.38,8 v34.5,4.12 | R6.1 26,16.88 24,16.88 R14.1 v24,18.12 | v72.12,9.38 71.75,9.75 66.88,9.75 v65.25,11.38 | v62.38,12.62 58.38,16.62 57,16.62 JP3.6
+12V  (via drill 0.61)
  Top 0.254: v65.88,4.88 65.62,4.88 65.62,3.12 U$4.30 | v69,3 69.62,2.38 92.38,2.38 94.25,4.25 95,4.25 | 95,4.25 95.5,4.25 95.75,4.5 98.75,4.5 99.12,4.12 99.12,3.12 U$5.27 | v100.88,4.88 101.5,4.88 101.5,3.12 U$5.30 | 95,4.25 v95,3.88 | 7.38,10.5 6.38,10.5 5.88,10 C10.1 | 7.38,10.5 IC1.9 | v7.38,10.12 7.38,10.5 | v7.38,12.62 7.38,14.88 9.12,14.88 R8.1 9.25,15 11.25,17 C9.1 14.25,17 15.12,17.88 18.12,17.88 20,16 L2.2 | U$6.1 7,28.88 13,28.88 U$6.8 | U$6.8 13,28.75 13,27.75 U$6.7 13.12,27.62 13.12,26.38 U$6.6 13,26.25 11.62,26.25 11.62,24.62 11.88,24.38 11.88,19 11.75,18.88 v11.75,18.38 | U$6.8 13.12,29 13.88,29.75 36.5,29.75 C12.+ 41.25,24.88 41.12,24.88 v37,20.75 | v59,18 58.75,17.75 51.62,17.75 v51.38,17.5 | v48.12,13.5 47.62,14 41.5,14 41,14.5 41,17 40.5,17.5 38.5,17.5 37.5,18.5 v37,18.5
  Bottom 0.254: v69,3 67.75,3 v65.88,4.88 65.25,4.88 64.38,4 63.62,4 63.12,4.5 63.12,5.38 64.5,6.75 64.5,9.5 64,10 64.12,12.88 v59,18 | v100.88,4.88 99.88,3.88 v95,3.88 | v7.38,10.12 v7.38,12.62 7.38,14 v11.75,18.38 | v51.38,17.5 51.38,15.25 50.62,14.5 50.12,14.5 49.12,13.5 v48.12,13.5 | v37,20.75 v37,18.5
ACCEL_INT  (1 unrouted)
AMBIENT_AD
  Top 0.254: U$2.41 88.88,24.5 89.88,24.5 90,24.38 93.25,24.38 93.75,23.88 106,23.88 106.88,23 118.75,23 119.75,22 R3.2 119.88,22 119.88,20 C6.1 119.75,20 118.88,19.12 118.12,19.12 118.12,16 D1.K
DIGIT0_0  (via drill 0.61)
  Top 0.254: v20.75,11.25 24.38,7.62 28.38,7.62 30.25,5.75 38.25,5.75 39,5 42,5 43,5.75 44.38,5.75 47.38,2.75 54.12,2.75 55.25,3.88 55.25,4.75 57,4.75 57.62,5.38 U$4.22
  Bottom 0.254: v20.75,11.25 20,12 20,12.38 N1.0
DIGIT0_1  (via drill 0.61)
  Top 0.254: v31.12,11.38 31.38,11.12 39.12,11.12 39.38,10.88 51.75,10.88 v52.62,10 | v53.38,7.38 53.75,7 54.12,7 54.62,6.5 56.38,6.5 56.62,6.25 57.62,6.25 U$4.21
  Bottom 0.254: v31.12,11.38 30.12,12.38 N1.1 | v52.62,10 52.62,9.5 53.38,8.75 v53.38,7.38
DIGIT0_2  (via drill 0.61)
  Top 0.254: v32.62,13.88 34.88,11.62 39.38,11.62 39.62,11.38 52.5,11.38 v53.88,10 | v55,7.38 55.25,7.12 57.62,7.12 U$4.20
  Bottom 0.254: v32.62,13.88 31.25,15.25 N1.2 | v53.88,10 53.88,8.5 v55,7.38
DIGIT0_3  (via drill 0.61)
  Top 0.254: v34.62,10.25 34.75,10.38 51,10.38 v51.38,10 | v52.5,8.25 56.12,8.25 56.5,7.88 57.62,7.88 U$4.19
  Bottom 0.254: v34.62,10.25 34.62,14.38 30.88,18.12 N1.3 | v51.38,10 52.5,8.88 v52.5,8.25
DIGIT0_4  (via drill 0.61)
  Top 0.254: v36.38,8 36.62,8.25 43.25,8.25 45.88,5.62 v46,5.62 | v55.88,9.25 56.5,8.62 57.62,8.62 U$4.18
  Bottom 0.254: v36.38,8 32.62,8 32.25,8.38 32.25,11.88 30.62,13.5 30.5,13.5 29.38,14.62 29.38,16.38 29.12,16.62 29.12,20.62 N1.4 | v46,5.62 48.62,5.62 49.12,6.12 49.12,9.62 48.75,10 48.75,10.5 48.25,11 48.25,11.38 49.12,12.25 50.75,12.25 52.12,10.88 54.25,10.88 v55.88,9.25
DIGIT0_5  (via drill 0.61)
  Top 0.254: v34.25,18.5 34.25,16.25 37.25,13.25 39.75,13.25 40,13 v40,12.25 | v48.25,6.5 49.38,5.38 53,5.38 v53.38,5 | v60.75,9.12 60,9.88 59.12,9.88 58.75,9.5 57.75,9.5 U$4.17
  Bottom 0.254: v34.25,18.5 29.5,23.25 27.62,23.25 26.5,22.12 N1.5 | v40,12.25 40,11.88 45.38,6.5 v48.25,6.5 | v53.38,5 53.88,5 54,5.12 55.12,5.12 55.5,4.75 57.75,4.75 60.75,7.75 v60.75,9.12
DIGIT0_6  (via drill 0.61)
  Top 0.254: v26.12,13.62 30.38,9.38 35,9.38 35.5,9.88 50.25,9.88 51,9.12 54.5,9.12 55.5,10.12 57.62,10.12 U$4.16
  Bottom 0.254: v26.12,13.62 21.62,13.62 20.88,14.38 20.88,18 21,18.38 21,18.5 22.62,20.12 22.62,20.62 23.5,21.5 23.5,22 N1.6
DIGIT0_7  (via drill 0.61)
  Top 0.254: v35.5,18.5 35.5,16 37.5,13.75 40,13.75 41.75,12 42,12 42.12,11.88 54.75,11.88 55.62,11 57.62,11 U$4.15
  Bottom 0.254: v35.5,18.5 30.25,23.75 22.75,23.75 21,22 21,20.75 N1.7
DIGIT0_8  (via drill 0.6)
  Top 0.254: v63,11 62.5,11 61.75,11.75 U$4.14
  Bottom 0.254: N1.8 19.2,18.2 17,16 17,12 26.25,2.75 52.25,2.75 53.5,1.75 58.75,1.75 64,7 64,9 63,10 v63,11
DIGIT0_9  (via drill 0.61)
  Top 0.254: v50.62,6.88 49.25,8.25 v48.25,8.25 | v50.5,13.62 51.25,12.88 56.38,12.88 56.62,12.62 57.62,12.62 U$4.13
  Bottom 0.254: v50.62,6.88 47.25,3.25 26.62,3.25 17.62,12.25 17.62,14.12 18.75,15.25 N1.9 | v48.25,8.25 48.25,10.12 47.5,10.88 47.5,11.38 49.12,13 49.88,13 v50.5,13.62
DIGIT0_LD  (via drill 0.61)
  Top 0.254: v40,20.75 43,23.75 48.12,23.75 50.62,26.25 v54.25,26.25 | v62.75,22.88 62.75,20.62 62.5,20.62 60.38,18.5 60.38,17 60.12,16.75 60.12,15.75 U$4.11
  Bottom 0.254: v40,20.75 37.88,18.62 37.88,8.25 36.75,7.12 25.25,7.12 23.38,9 23.38,9.25 22.12,10.5 N1.LHDP | v54.25,26.25 55.12,25.38 58,25.38 58.62,26 59.62,26 v62.75,22.88
DIGIT0_RD  (via drill 0.61)
  Top 0.254: v30,8 30.38,8.38 35.5,8.38 36,8.88 43.38,8.88 45.75,6.5 46.38,6.5 46.88,6 46.88,4 v51.12,4 | v59.5,12.88 59.12,13.25 57.75,13.25 U$4.12
  Bottom 0.254: v30,8 30,8.5 28,10.5 N1.RHDP | v51.12,4 53.62,6.5 55.38,6.5 56.75,7.88 56.75,9.88 55,11.62 55,12.38 55.5,12.88 v59.5,12.88
DIGIT1_0  (via drill 0.61)
  Top 0.254: v42.38,16.12 44,17.75 45.88,17.75 v50.12,22 | v56,14 65.62,14 66.25,14.62 66.25,15.62 U$4.3
  Bottom 0.254: v42.38,16.12 43.25,15.25 43.25,13.75 42,12.5 N2.0 | v50.12,22 50.5,22.38 51.88,22.38 54.5,19.75 54.5,15.88 56,14.38 v56,14
DIGIT1_1  (via drill 0.61)
  Top 0.254: v52,14.12 53.38,15.5 58.25,15.5 59.38,16.62 59.38,17.12 59.88,17.62 59.88,20.12 v60.75,20.12 | v62,18.88 62,17.12 66.75,17.12 67.12,16.75 67.12,15.75 U$4.2
  Bottom 0.254: v52,14.12 52,12.5 N2.1 | v62,18.88 v60.75,20.12
DIGIT1_2  (via drill 0.61)
  Top 0.254: v54.25,14.25 54.88,14.88 v58.88,14.88 | v60.75,13 61.25,13.5 66.12,13.5 66.88,14.25 67.5,14.25 67.88,14.62 67.88,15.62 U$4.1
  Bottom 0.254: v54.25,14.25 53.25,15.25 N2.2 | v60.75,13 v58.88,14.88
DIGIT1_3  (via drill 0.61)
  Top 0.254: v50,19.25 50,21.12 50.5,21.12 51,21.62 51,22.88 58.25,22.88 v59.62,21.5 | v63.75,18.5 64.5,19.25 v67.88,19.25 | v69,15.12 69,13.38 70.25,13.38 U$4.44
  Bottom 0.254: v50,19.25 50.38,18.88 51.38,18.88 52,18.25 52.75,18.25 N2.3 | v59.62,21.5 59.62,20 61.62,18 63.25,18 v63.75,18.5 | v67.88,19.25 67.88,18.75 69,17.62 v69,15.12
DIGIT1_4  (via drill 0.61)
  Top 0.254: v52.38,19.88 53.12,20.62 60,20.62 60.38,21 v61.62,21 | v62.88,19.75 62.88,17.62 67.75,17.62 71.75,13.62 71.75,12.62 70.38,12.62 U$4.43
  Bottom 0.254: v52.38,19.88 51.62,20.62 51.12,20.62 N2.4 | v62.88,19.75 v61.62,21
DIGIT1_5  (via drill 0.61)
  Top 0.254: v49.5,23.12 50,23.62 54,23.62 55.75,25.38 59,25.38 v59.25,25.12 | v67,13.12 68,12.12 69,12.12 69.38,11.75 70.25,11.75 U$4.42
  Bottom 0.254: v49.5,23.12 48.5,22.12 N2.5 | v59.25,25.12 67,17.38 v67,13.12
DIGIT1_6  (via drill 0.61)
  Top 0.254: v65.75,12.62 66.75,11.62 68.62,11.62 69.25,11 70.25,11 U$4.41
  Bottom 0.254: v65.75,12.62 65.75,12.75 57.88,20.62 54.75,20.62 51.38,24 48,24 46.12,22.12 45.62,22.12 N2.6
DIGIT1_7  (via drill 0.61)
  Top 0.254: v68.38,10.62 68.75,10.25 70.25,10.25 U$4.40
  Bottom 0.254: v68.38,10.62 68.38,13.75 68.12,14 68.12,17.75 67,18.88 67,20 59,28 49,28 43,22 43,20.75 N2.7
DIGIT1_8  (via drill 0.61)
  Top 0.254: v44,4.88 46.62,2.25 56.5,2.25 v57.38,3.12 | v62.25,9.12 62.38,9.25 70.12,9.25 70.25,9.38 U$4.39
  Bottom 0.254: v44,4.88 39.12,9.75 39.12,16.12 41.12,18.12 N2.8 | v57.38,3.12 57.38,3.62 62.25,8.5 v62.25,9.12
DIGIT1_9  (via drill 0.61)
  Top 0.254: v42.38,14.88 42.75,14.5 48.38,14.5 50.5,12.38 55.5,12.38 v55.88,12 | v59.5,9 60.25,8.25 69,8.25 69.25,8.5 70.25,8.5 U$4.38
  Bottom 0.254: v42.38,14.88 42,15.25 40.88,15.25 N2.9 | v55.88,12 56.5,12 v59.5,9
DIGIT1_LD  (via drill 0.61)
  Top 0.254: v45.75,7.75 46.5,7 46.62,7 47.38,6.25 47.38,4.88 52,4.88 v53.25,3.62 | v62.12,6.62 62.5,7 70.25,7 U$4.36
  Bottom 0.254: v45.75,7.75 44.12,9.38 44.12,10.5 N2.LHDP | v53.25,3.62 53.75,3.62 54.5,2.88 56.38,2.88 57,2.25 57.75,2.25 v62.12,6.62
DIGIT1_RD  (via drill 0.61)
  Top 0.254: v50.5,8.25 52.25,6.5 53.88,6.5 54.38,6 55.5,6 v55.88,5.62 | v59.5,7.75 70.25,7.75 U$4.37
  Bottom 0.254: v50.5,8.25 49.88,8.88 49.88,10.5 N2.RHDP | v55.88,5.62 57.38,5.62 v59.5,7.75
DIGIT2_0  (via drill 0.61)
  Top 0.254: v88.88,6.5 89.25,6.12 92,6.12 92.62,5.5 93.62,5.5 U$5.22
  Bottom 0.254: v88.88,6.5 89,6.5 88.5,6 88.5,4 87.5,3 78.62,3 77.25,4.38 77.25,6.88 76.75,7.38 76.25,7.38 73,10.62 73,12.38 N3.0
DIGIT2_1  (via drill 0.61)
  Top 0.254: v87.12,7 87.5,7.38 89.88,7.38 90.62,6.62 92.25,6.62 92.62,6.25 93.62,6.25 U$5.21
  Bottom 0.254: v87.12,7 87.12,8.38 83.12,12.38 N3.1
DIGIT2_2  (via drill 0.61)
  Top 0.254: v85.5,11.62 87,10.12 89.25,10.12 91,8.38 91.38,8.38 92.62,7.12 93.62,7.12 U$5.20
  Bottom 0.254: v85.5,11.62 85.5,14 84.25,15.25 N3.2
DIGIT2_3  (via drill 0.61)
  Top 0.254: v91,9.62 92.25,8.38 92.25,8.25 92.62,7.88 93.62,7.88 U$5.19
  Bottom 0.254: v91,9.62 91,11.75 90.5,12.25 90.25,12.25 84.38,18.12 83.88,18.12 N3.3
DIGIT2_4  (via drill 0.61)
  Top 0.254: v88.38,11.12 88.88,10.62 89.62,10.62 89.75,10.5 v91.88,10.5 | v95.5,8.12 95.12,8.5 93.75,8.5 U$5.18
  Bottom 0.254: v88.38,11.12 88.38,13.38 84.75,17 83.38,17 82.62,17.75 82.62,19 82.12,19.5 82.12,20.62 N3.4 | v91.88,10.5 92.88,10.5 95.25,8.12 v95.5,8.12
DIGIT2_5  (via drill 0.61)
  Top 0.254: v95.5,9.38 93.75,9.38 U$5.17
  Bottom 0.254: v95.5,9.38 94.75,9.38 87.75,16.38 87.75,18.38 83.5,22.62 83,22.62 82.38,23.25 80.62,23.25 79.5,22.12 N3.5
DIGIT2_6  (via drill 0.61)
  Top 0.254: v88.62,17.5 88.88,17.25 v90.38,17.25 | v93.12,20 93.5,20.38 97.75,20.38 99.12,19 100.5,19 102.38,17.12 108.75,17.12 112.25,13.62 112.25,4.75 104.62,4.75 101.75,7.62 98.38,7.62 96.38,9.62 96.38,9.88 96.25,9.88 95.88,10.25 93.75,10.25 U$5.16
  Bottom 0.254: v88.62,17.5 88.62,18.25 83.75,23.12 83.25,23.12 82.62,23.75 78.75,23.75 77.12,22.12 76.62,22.12 N3.6 | v93.12,20 v90.38,17.25
DIGIT2_7  (via drill 0.61)
  Top 0.254: v73.88,19.12 73.88,15.5 74.88,15.5 76.5,13.88 76.5,9.75 78.38,7.88 90.62,7.88 v91,7.5 | v95.5,6.88 95.62,6.75 v100.25,6.75 | v102.5,9 102.38,8.88 99.62,8.88 98.38,10.12 96.88,10.12 96.25,10.75 94.88,10.75 94.75,10.88 93.75,10.88 U$5.15
  Bottom 0.254: v73.88,19.12 73.88,20.62 N3.7 | v91,7.5 94.88,7.5 v95.5,6.88 | v102.5,9 v100.25,6.75
DIGIT2_8  (1 unrouted)
DIGIT2_9  (via drill 0.61)
  Top 0.254: v71,16.5 70.62,16.88 70,16.88 68.75,18.12 68.75,22.88 v67.88,22.88 | v85.12,24.88 85.12,22.12 v86.88,22.12 | v91.25,14.25 91.5,14 94.75,14 95.12,13.62 95.12,12.62 93.75,12.62 U$5.13
  Bottom 0.254: v71,16.5 71.75,15.75 71.75,15.38 N3.9 | v67.88,22.88 67.88,24.62 67.5,25 67.5,27.38 68.88,28.75 83.12,28.75 84.75,27.12 84.75,25.25 v85.12,24.88 | v86.88,22.12 91,22.12 92.25,20.88 93.5,20.88 94,20.38 94,19.62 91.25,16.88 v91.25,14.25
DIGIT2_LD  (via drill 0.61)
  Top 0.254: v81.62,18.75 82,18.38 89,18.38 89.25,18.12 94.62,18.12 96,16.75 96,15.75 U$5.11
  Bottom 0.254: v81.62,18.75 80.25,17.38 80.25,16.5 79.75,16 78.25,16 78,15.75 78,13.5 75.12,10.62 N3.LHDP
DIGIT2_RD  (via drill 0.61)
  Top 0.254: v90.12,11.38 92,13.25 93.62,13.25 U$5.12
  Bottom 0.254: v90.12,11.38 89.88,11.38 87.62,9.12 87.62,8.38 88,8 88,6.62 87.5,6.12 85.38,6.12 81,10.5 N3.RHDP
DIGIT3_0  (via drill 0.61)
  Top 0.254: v96.25,13.25 97.25,14.25 101.88,14.25 102.25,14.62 102.25,15.62 U$5.3
  Bottom 0.254: v96.25,13.25 95.5,12.5 95,12.5 N4.0
DIGIT3_1  (via drill 0.61)
  Top 0.254: v103.88,13.38 103,14.25 103,15.62 103.12,15.62 U$5.2
  Bottom 0.254: v103.88,13.38 104.75,12.5 105,12.5 N4.1
DIGIT3_2  (via drill 0.61)
  Top 0.254: v107.38,14.38 106.12,15.62 104,15.62 U$5.1
  Bottom 0.254: v107.38,14.38 107.12,14.38 106.25,15.25 N4.2
DIGIT3_3  (via drill 0.61)
  Top 0.254: v104.75,14.25 105.62,13.38 106.25,13.38 U$5.44
  Bottom 0.254: v104.75,14.25 104.38,14.62 104.38,16.75 105.75,18.12 N4.3
DIGIT3_4  (via drill 0.61)
  Top 0.254: v102.5,13.38 103.38,12.5 106.25,12.5 U$5.43
  Bottom 0.254: v102.5,13.38 103.75,14.62 103.75,16.88 104.12,17.25 104.12,20.62 N4.4
DIGIT3_5  (via drill 0.61)
  Top 0.254: v107.62,16.25 107.62,15.25 107.75,15.25 108.25,14.75 108.25,11.75 106.38,11.75 U$5.42
  Bottom 0.254: v107.62,16.25 107.62,19.88 104.25,23.25 102.62,23.25 101.5,22.12 N4.5
DIGIT3_6  (via drill 0.61)
  Top 0.254: 106,21 105.88,21.12 | 105.88,21.12 v99.88,21.12 | 105.88,21.12 107.25,19.88 v110.12,17 | v108.88,15.75 108.88,11 106.38,11 U$5.41
  Bottom 0.254: v99.88,21.12 99,22 98.62,22 N4.6 | v108.88,15.75 v110.12,17
DIGIT3_7  (via drill 0.61)
  Top 0.254: v96.75,21.88 96.88,22 106.38,22 112,16.38 v112,15.12 | v110.75,13.88 110.75,10.25 106.38,10.25 U$5.40
  Bottom 0.254: v96.75,21.88 96,21.12 96,20.75 N4.7 | v110.75,13.88 v112,15.12
DIGIT3_8  (via drill 0.61)
  Top 0.254: v96.12,11.62 97.12,10.62 104.12,10.62 105.25,9.5 106.25,9.5 U$5.39
  Bottom 0.254: v96.12,11.62 95.25,10.75 94.12,10.75 92.12,12.75 92.12,16.12 94.12,18.12 N4.8
DIGIT3_9  (via drill 0.61)
  Top 0.254: v101.5,9.75 101.62,9.88 104.12,9.88 104.88,9.12 104.88,8.62 106.25,8.62 U$5.38
  Bottom 0.254: v101.5,9.75 101.75,10 101.75,10.5 100.62,11.62 99.62,11.62 97.12,14.12 95.62,14.12 94.5,15.25 93.88,15.25 N4.9
DIGIT3_LD  (via drill 0.61)
  Top 0.254: v98,9.25 99.12,8.12 103.88,8.12 104.88,7.12 106.25,7.12 U$5.36
  Bottom 0.254: v98,9.25 97.12,10.12 97.12,10.5 N4.LHDP
DIGIT3_RD  (via drill 0.61)
  Top 0.254: v103.75,9 104.88,7.88 106.25,7.88 U$5.37
  Bottom 0.254: v103.75,9 103.75,9.12 103,9.88 103,10.5 N4.RHDP
GND  (via drill 0.6)  (12 unrouted)
  Top 0.254: IC1.8 5.25,11 4.25,12 C7.2 | IC1.4 13.12,11.5 13.88,12.25 15.12,12.25 16,13.12 R9.2
  other vias: 110,7 100,13 98,12 83,11 73,4 43,1.75 35,1.75 45,13 36,13 36.75,16.75 43,29 46,29 40,7 7,23 10,30 30,28 19,26 20,22 7,16 16,10 2,8 2,11 21,6 10,6 14,2 13,23 107,2 31,4.75 37.5,4.5
  pour Top: -1,33 127,33 127,-1 -1,-1
  pour Bottom: 0,37 -2,37 -2,-6 130,-6 130,39 0,39
HV_BLANK  (via drill 0.61)  (1 unrouted)
  Top 0.254: v69.12,4.25 68,4.25 68,3.12 U$4.33 | v101.5,6.62 103.88,4.25 103.88,3.12 U$5.33
  Bottom 0.254: v69.12,4.25 70.5,2.88 78,2.88 78.38,2.5 90,2.5 93,5.5 99,5.5 99.38,5.88 100.75,5.88 v101.5,6.62
HV_FB
  Top 0.254: C14.1 14.25,20 16.25,22 R13.1 16.25,22.12 16.25,24 R12.2 16.12,24.12 14,24.12 13.12,25 U$6.5
HV_LOAD  (via drill 0.61)
  Top 0.254: U$2.28 83,16.12 83.12,16 83.12,14.75 77.38,14.75 77,14.38 77,10 79.38,10 80.62,8.75 v84.12,8.75 | U$5.31 102.25,3.12 102.25,4.88 101.38,5.75 96.25,5.75 95.25,4.75 92.62,4.75 91.75,5.62 87.25,5.62 v85.88,7 85.75,7 85.38,7.38 73.12,7.38 v72.12,6.38 | v67.12,4.88 66.38,4.12 66.38,3.12 U$4.31
  Bottom 0.254: v85.88,7 v84.12,8.75 | v67.12,4.88 67.12,5.25 68.25,6.38 v72.12,6.38
HV_SHIFT  (1 unrouted)
I2C_SCL  (via drill 0.61)
  Top 0.254: v76.38,6.5 77.25,5.62 78.5,5.62 79,5.12 79.75,5.12 79.88,5 U$3.P$14 | v73.62,22.38 73.75,22.25 77.12,22.25 U$2.18
  Bottom 0.254: v76.38,6.5 70.12,12.75 70.12,19.38 73.12,22.38 v73.62,22.38
I2C_SDA  (via drill 0.61)
  Top 0.254: v78.5,6.5 79.62,6.5 80,6.12 U$3.P$13 | v76.75,8.25 76.75,8.75 75.25,10.25 75.25,14.38 74.25,14.38 73,15.62 73,20.5 75.62,20.5 76.5,21.38 77.12,21.38 U$2.19
  Bottom 0.254: v76.75,8.25 v78.5,6.5
LED_PWM
  Top 0.254: Q4.1 87.88,14.12 86,16 85.12,16 84.62,16.5 84.62,17.12 U$2.30
N$1
  Top 0.254: R5.1 27,4.75 26.62,4.38 24.62,4.38 IC2.2
N$2  (via drill 0.61)
  Top 0.254: v88,29 C1.1 | v85.62,26.62 85.38,26.38 83,26.38 82.5,26.88 82.5,27.62 83,28.12 U$2.6
  Bottom 0.254: v85.62,26.62 v88,29
N$3  (via drill 0.61)
  Top 0.254: v92.12,23.5 92.25,23.38 93.75,23.38 94.12,23 C3.1 | v90.38,25.25 90.25,25.38 88.88,25.38 U$2.42
  Bottom 0.254: v90.38,25.25 v92.12,23.5
N$4
  Top 0.254: C5.1 71.88,19 71.88,21.75 72.12,21.75 Q1.3 71.88,21.88 73.25,23.25 74,23.25 74.12,23.12 77,23.12 77.12,23 U$2.17
N$5
  Top 0.254: C4.1 70.12,29 70.12,26.25 69.88,26.25 Q1.1 70.12,26.12 72.5,23.75 77.12,23.75 U$2.16
N$6
  Top 0.254: R2.1 78,13.88 84.5,13.88 85.38,13 88.62,13 88.88,13.25 88.88,16.62 87.5,16.62 87,17.12 U$2.33
N$7
  Top 0.254: R7.1 29,4.88 28.12,5.75 24.62,5.75 IC2.3
N$8
  Top 0.254: L1.1 11.5,5 11.5,10 IC1.1
N$9
  Top 0.254: L1.2 8.5,5 8.5,10 IC1.10
N$10
  Top 0.254: IC1.3 13.88,11 14,10.88 C8.1
N$12
  Top 0.254: R8.2 10.88,15 11,14.88 13.88,14.88 R10.1 14,14.88 16,14.88 R9.1 15.88,15 15.88,17 C9.2
N$13  (via drill 0.61)
  Top 0.254: 24,25.88 22.12,24 D2.A | Q2.D 24,25.88 | v30.75,20.75 29.25,20.75 24.12,25.88 24,25.88 | v33,18.5 30.5,16 L2.1
  Bottom 0.254: v33,18.5 v30.75,20.75
N$14
  Top 0.254: C15.1 10.75,23 10.75,26.25 7,26.25 U$6.3
N$15
  Top 0.254: IC1.5 11.5,12 12.62,13.12 14,13.12 R10.2
N$16  (via drill 0.61)
  Top 0.254: Q2.G 20.88,28.38 17.12,28.38 17,28.25 R11.1 16.88,28.25 15.25,28.25 v14.88,27.62 | v11.25,27.62 7,27.62 U$6.2
  Bottom 0.254: v14.88,27.62 v11.25,27.62
N$17
  Bottom 0.254: LED1.A 26,15.25 R6.2
N$18
  Bottom 0.254: LED2.A 24,15.25 R14.2
N$19
  Bottom 0.254: LED3.A 48,15.25 R15.2
N$20
  Bottom 0.254: LED4.A 46,15.25 R16.2
N$21
  Bottom 0.254: LED5.A 79,15.25 R17.2
N$22
  Bottom 0.254: LED6.A 77,15.25 R18.2
N$23
  Bottom 0.254: LED7.A 101,15.25 R19.2
N$24
  Bottom 0.254: LED8.A 99,15.25 R20.2
N$25  (via drill 0.61)
  Top 0.254: v44.25,19.12 43.5,19.88 26.75,19.88 v26.38,20.25 | v75,17.88 77.25,15.62 v82.12,15.62 | v95,16.25 90.38,16.25 90.38,14 88.88,12.5 87.5,12.5 87,12 Q4.3 87.38,12.5 81.62,12.5 v81.12,13 | v50,17.88 51.5,19.38 51.5,21.88 v54.75,21.88 | v59.5,22.88 60.38,23.75 68.75,23.75 69.38,23.12 70.62,23.12 70.88,22.88 70.88,19.88 69.5,19.88 69.25,19.62 69.25,18.38 70.25,17.38 71.38,17.38 72.5,16.25 72.5,14.12 v73.25,14.12
  Bottom 0.254: LED2.C 22,18.75 24.38,21.12 25.12,21.12 26.19,20.06 | 26.19,20.06 28,18.25 LED1.C | v44.25,19.12 44,18.88 LED4.C 44.5,16.75 45.25,16 48.75,16 49.5,16.75 LED3.C v50,17.88 | 26.19,20.06 v26.38,20.25 | v75,17.88 LED6.C 74.12,16.75 73.62,16.25 73.62,14.5 v73.25,14.12 | LED5.C v82.12,15.62 82.12,15.5 82.38,15.25 82.38,14.25 v81.12,13 | LED7.C 103,17.38 101.38,19 98.25,19 97,17.75 LED8.C 95.5,16.75 v95,16.25 | v54.75,21.88 55.75,22.88 v59.5,22.88
N$40
  Top 0.254: TP1.TP 96,3 U$5.23
RESET  (via drill 0.61)
  Top 0.254: v107.25,24.38 100.38,24.38 | 100.38,24.38 96.5,24.38 95.88,25 R1.1 | v108.5,25.62 108.5,26.12 108.12,26.5 108.12,29.25 107,29.25 JP2.6 | U$2.13 77,26 75.88,26 v75.62,25.75 | 100.38,24.38 v100.38,24.75
  Bottom 0.254: v108.5,25.62 v107.25,24.38 | v75.62,25.75 81.38,25.75 83.12,24 86.62,24 90.5,27.88 97.25,27.88 v100.38,24.75
SPI0_MOSI  (1 unrouted)
SPI0_SCLK  (via drill 0.61)
  Top 0.254: v73.25,24.62 76.25,27.62 80.5,27.62 80.5,28.75 U$2.9 | v67.88,21.62 66.38,20.12 v65.62,20.12 | v67.12,10.75 66.5,10.12 v65.25,10.12 | U$4.28 v64,4.88 | U$5.28 100,4.88 v99.62,4.88 | v92.62,3.88 91.38,5.12 v85.5,5.12 | v78.12,4.75 77.75,5.12 74.62,5.12 v73.38,6.38
  Bottom 0.254: v73.25,24.62 70.25,21.62 v67.88,21.62 | v65.62,20.12 65.62,19.5 67.62,17.5 67.62,13.75 67.88,13.5 67.88,11.5 v67.12,10.75 | 65.25,7.25 65.25,6.12 v64,4.88 | 65.25,7.25 v65.25,10.12 | v99.62,4.88 99.5,4.75 93.5,4.75 v92.62,3.88 | v85.5,5.12 85.12,4.75 v78.12,4.75 | v73.38,6.38 72.5,7.25 65.25,7.25
TCK  (via drill 0.61)
  Top 0.254: v92.88,22.5 91.88,22.5 91.5,22.88 89,22.88 88.88,23 U$2.39 | v96.25,26.38 96.62,26.75 101.88,26.75 JP2.1
  Bottom 0.254: v92.88,22.5 92.88,23 v96.25,26.38
TDI  (1 unrouted)
TDO  (via drill 0.61)
  Top 0.254: v94.5,21.75 94.12,21.38 88.88,21.38 U$2.37
  Bottom 0.254: v94.5,21.75 96.5,23.75 98.62,23.75 98.75,23.62 101.25,23.62 104.38,26.75 JP2.3
TMS  (via drill 0.61)
  Top 0.254: U$2.38 88.62,22.38 87.88,22.38 87.25,23 v87.25,23.38 | v93.38,27 94.38,28 v103.62,28
  Bottom 0.254: v93.38,27 90.75,27 v87.25,23.38 | v103.62,28 105.62,28 107,26.62 JP2.5
UART_RXD  (via drill 0.61)
  Top 0.254: v81.25,24.62 82.75,23.12 82.75,21.25 82.25,20.75 80.62,20.75 80.5,20.62 U$2.20 | v69.25,24.5 69,24.25 57,24.25 JP3.3
  Bottom 0.254: v81.25,24.62 80.75,24.88 75,24.88 73.88,26 70.75,26 v69.25,24.5
UART_TXD  (via drill 0.61)
  Top 0.254: v83.38,25 83.38,21.12 82.5,20.25 80.88,20.25 80.25,19.8 U$2.21 | v68.38,26.62 68.25,26.75 57,26.75 JP3.2
  Bottom 0.254: v83.38,25 81.75,26.62 v68.38,26.62
USB_D+  (via drill 0.61)
  Top 0.254: v83.38,27.25 84.5,27.25 84.5,28.75 U$2.4 | v69.25,27.88 69.12,28 55.88,28 55.12,27.25 55.12,25.5 54.75,25.5 53.38,24.12 49.25,24.12 45.12,20 45.12,18.25 38.5,18.25 37.38,19.38 22.62,19.38 22.38,19.62 17.75,19.62 17.25,19.12 v12.75,19.12 | v11,20.88 9.12,19 K1.3
  Bottom 0.254: v83.38,27.25 82.75,27.88 v69.25,27.88 | v11,20.88 v12.75,19.12
USB_D-  (1 unrouted)
V+  (via drill 0.61)
  Top 0.254: v79.12,11 80.5,9.62 87.62,9.62 v88.5,8.75 | R12.1 D2.C 20,24 23.75,20.25 v24.75,20.25 | 28.62,8.12 26.62,8.12 v26.12,8.62 26.12,8.75 25.25,8.75 25.25,14 25.75,14.5 26.5,14.5 v26.5,18.5 | 28.62,8.12 29.75,7 C13.+ | 28.62,8.12 28.75,8.12 29.5,8.88 35.25,8.88 35.75,9.38 45.38,9.38 v45.75,9 45.88,9 47.5,7.38 48.62,7.38 50,6 53.62,6 54.12,5.5 54.38,5.5 v54.38,4.25 | v89.62,4.25 88.25,2.88 71.75,2.88 v70.38,4.25 | v68.5,5.38 68.12,5.75 59.75,5.75 58,4 56.38,4 v56.12,3.75
  Bottom 0.254: v79.12,11 78,9.88 N3.A | 91.25,6 v88.5,8.75 | 91.25,6 96.12,6 100,9.88 N4.A | v26.12,8.62 25,9.75 N1.A | v45.75,9 46.5,9.75 47,9.75 N2.A | v26.5,18.5 v24.75,20.25 | v89.62,4.25 91.25,5.88 91.25,6 | v70.38,4.25 69.25,5.38 v68.5,5.38 | v56.12,3.75 55.62,4.25 v54.38,4.25